# EAGLE design transponder-11.8.0 (EAGLE 9.6.2)
Assembly variants: SMT Stencil, Regulator, Zener

## Sheet 1 of 9
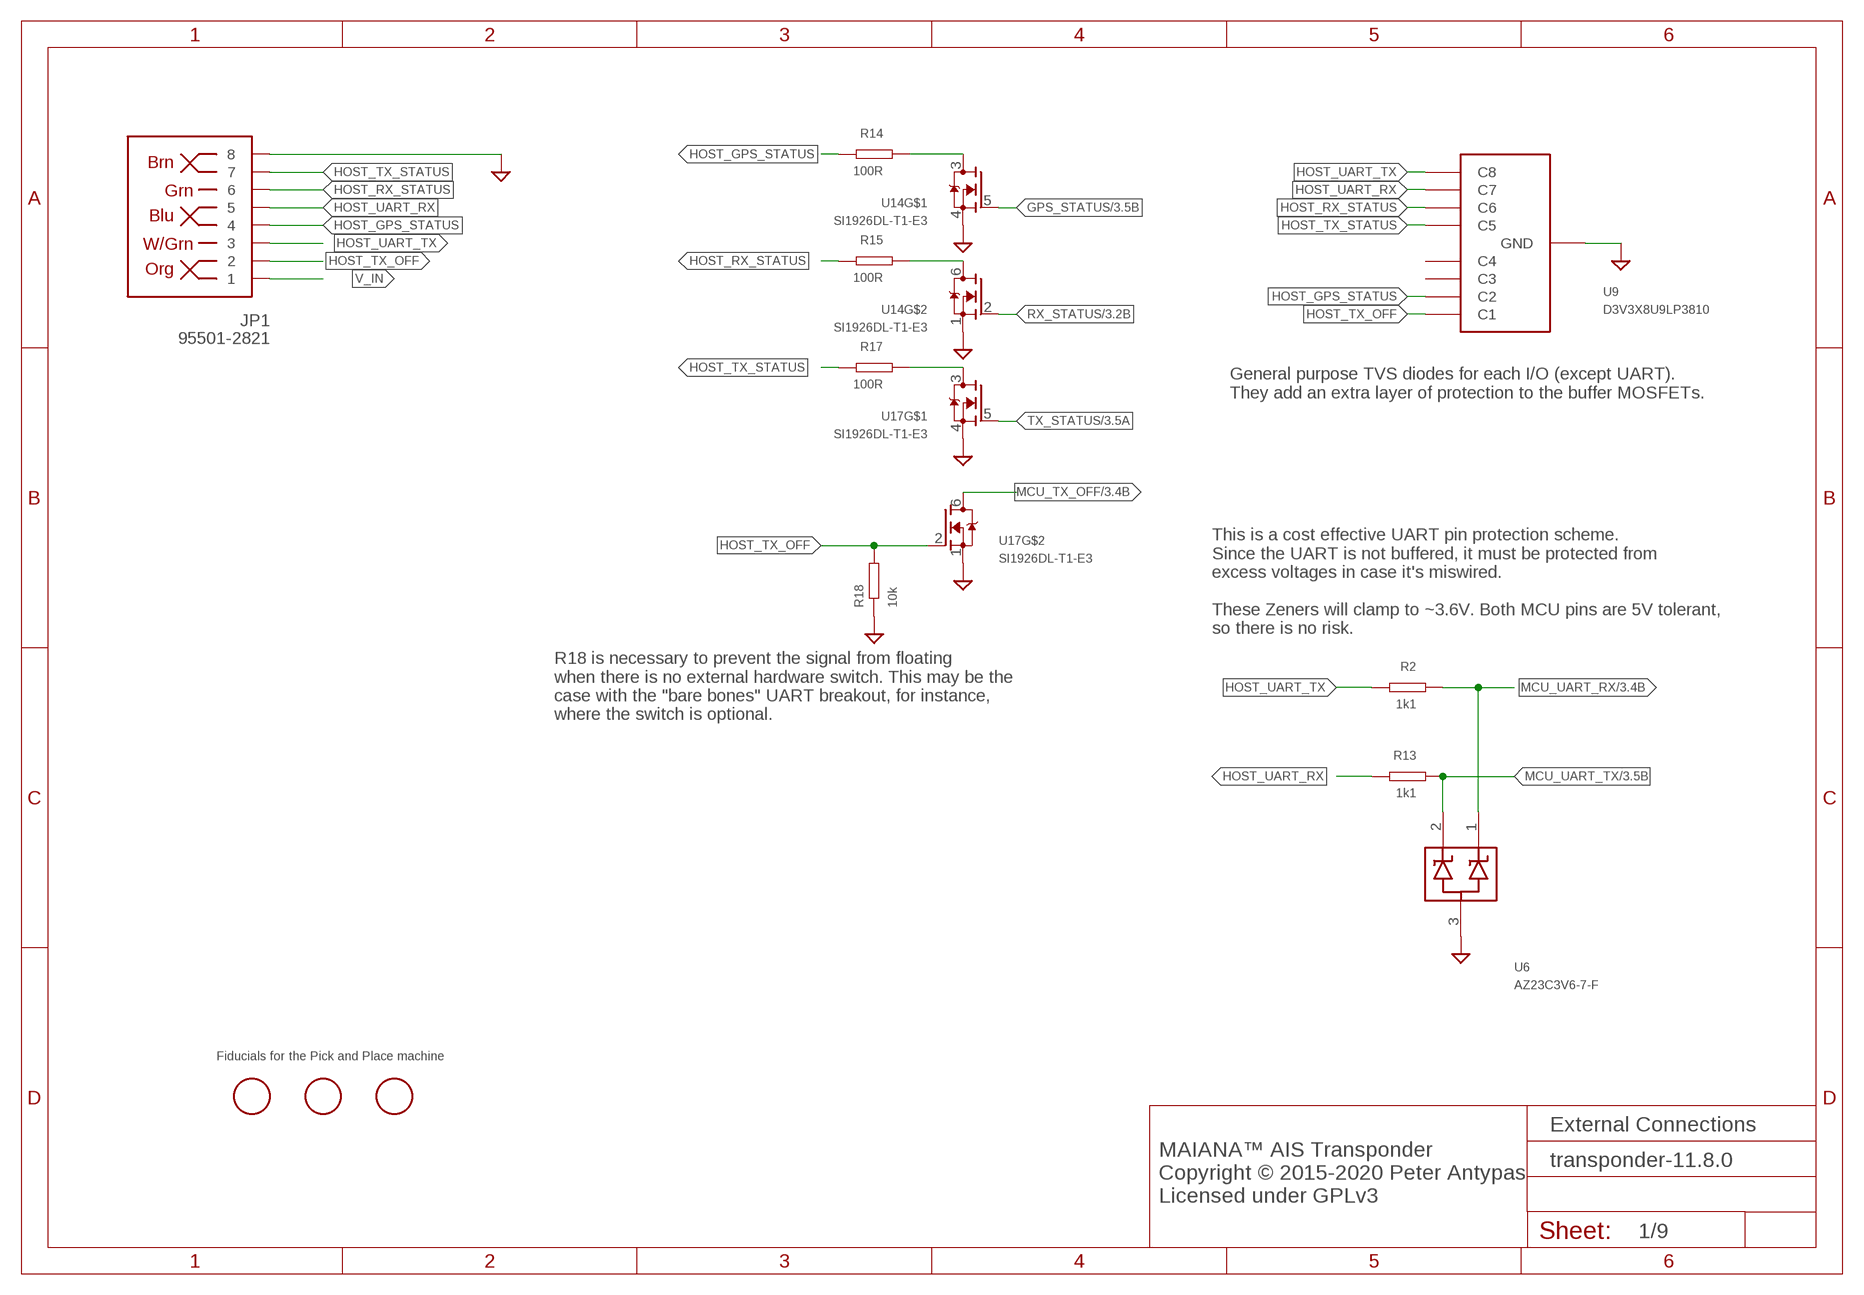
[diagram p0: schematic, sheet 1]

### Parts
JP1  95501-2821  RJ45-8PTH  [RJ45-8]  (not fitted in variant Regulator)  (not fitted in variant Zener)  (not fitted in variant SMT Stencil)
R2  1k1  RESISTOR0603  [0603]
R13  1k1  RESISTOR0603  [0603]
R14  100R  RESISTOR0603  [0603]
R15  100R  RESISTOR0603  [0603]
R17  100R  RESISTOR0603  [0603]
R18  10k  RESISTOR0603  [0603]
U6  AZ23C3V6-7-F  [SOT-23]
U9  D3V3X8U9LP3810  [U-DFN3810-9(B)]
U14  SI1926DL-T1-E3  DMN63D8LDW  [SOT363]
U17  SI1926DL-T1-E3  DMN63D8LDW  [SOT363]
U$1  FIDUCIAL  [FIDUCIAL_1MM]
U$2  FIDUCIAL  [FIDUCIAL_1MM]
U$3  FIDUCIAL  [FIDUCIAL_1MM]

### Nets
GND: JP1.8 R18.P$1 U6.3 U9.P$3(GND) U14.1(S) U14.4(S) U17.1(S) U17.4(S) ; also sheet 2,3,4,5,6,7,8,9
GPS_STATUS: U14.5(G) ; also sheet 3
HOST_GPS_STATUS: JP1.4 R14.P$2 U9.P$2(C2)
HOST_RX_STATUS: JP1.6 R15.P$2 U9.P$7(C6)
HOST_TX_OFF: JP1.2 R18.P$2 U9.P$1(C1) U17.2(G)
HOST_TX_STATUS: JP1.7 R17.P$2 U9.P$6(C5)
HOST_UART_RX: JP1.5 R13.P$2 U9.P$8(C7)
HOST_UART_TX: JP1.3 R2.P$2 U9.P$9(C8)
MCU_TX_OFF: U17.6(D) ; also sheet 3
MCU_UART_RX: R2.P$1 U6.1 ; also sheet 3
MCU_UART_TX: R13.P$1 U6.2 ; also sheet 3
N$13: R14.P$1 U14.3(D)
N$14: R15.P$1 U14.6(D)
N$20: R17.P$1 U17.3(D)
RX_STATUS: U14.2(G) ; also sheet 3
TX_STATUS: U17.5(G) ; also sheet 3
V_IN: JP1.1 ; also sheet 2
Unconnected: U9.P$4(C3) U9.P$5(C4)

### Notes on the sheet
- General purpose TVS diodes for each I/O (except UART).
  They add an extra layer of protection to the buffer MOSFETs.
- This is a cost effective UART pin protection scheme. 
  Since the UART is not buffered, it must be protected from 
  excess voltages in case it's miswired.
  
  These Zeners will clamp to ~3.6V. Both MCU pins are 5V tolerant,
  so there is no risk.
- R18 is necessary to prevent the signal from floating
  when there is no external hardware switch. This may be the
  case with the "bare bones" UART breakout, for instance,
  where the switch is optional.
- Fiducials for the Pick and Place machine
- External Connections
- MAIANA™ AIS Transponder
  Copyright © 2015-2020 Peter Antypas
  Licensed under GPLv3

## Sheet 2 of 9
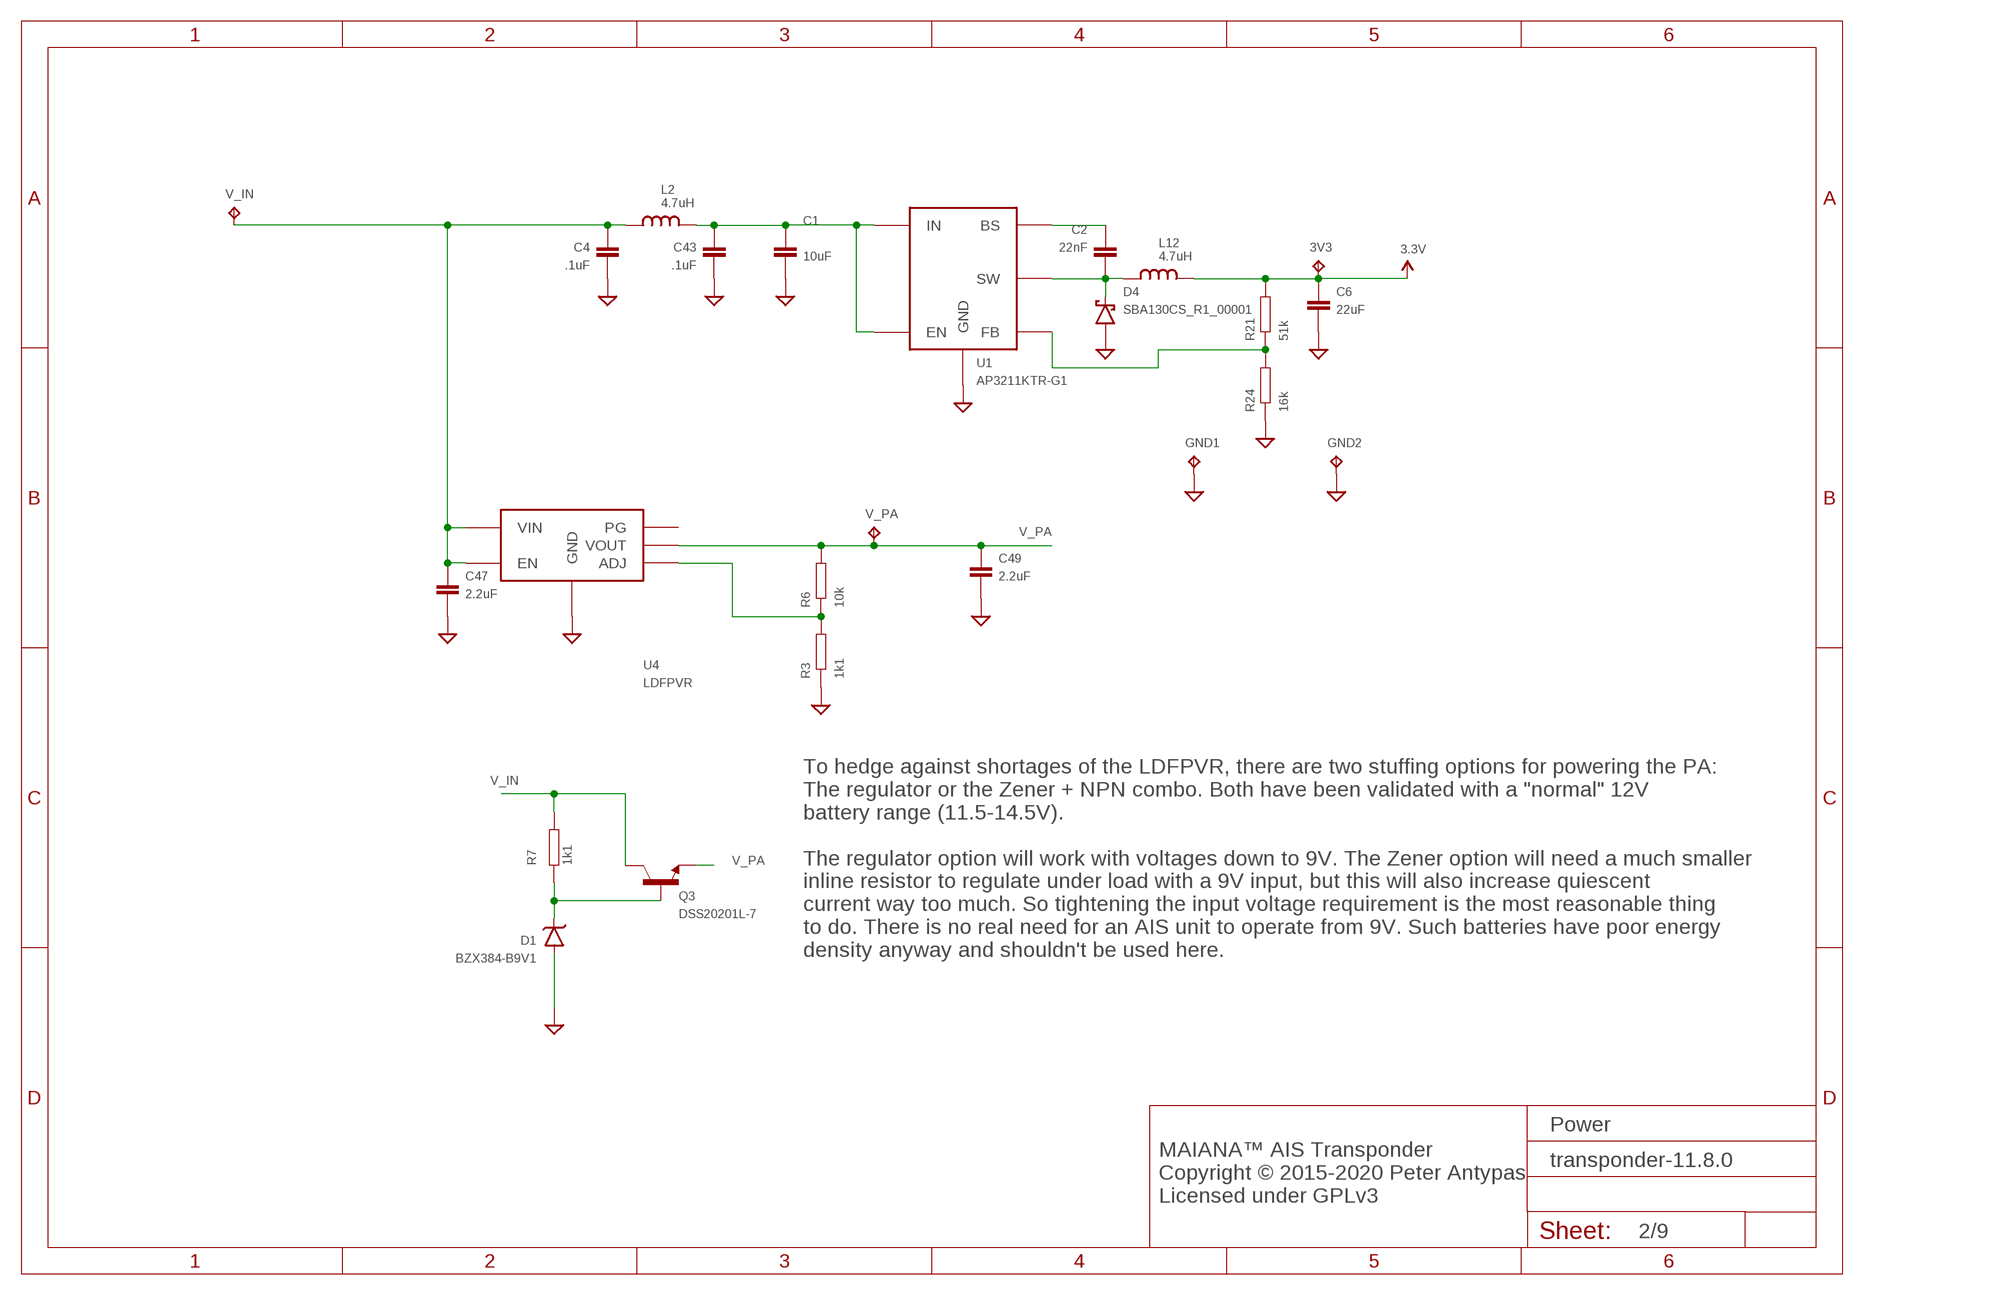
[diagram p1: schematic, sheet 2]

### Parts
3V3  TPTP12R  [TP12R]
C1  10uF  CAPACITOR0805  [0805]
C2  22nF  CAPACITOR0603  [0603]
C4  .1uF  CAPACITOR0603  [0603]
C6  22uF  CAPACITOR0805  [0805]
C43  .1uF  CAPACITOR0603  [0603]
C47  2.2uF  CAPACITOR0603  [0603]
C49  2.2uF  CAPACITOR0603  [0603]
D1  BZX384-B9V1  DIODE-ZENERSOD323  [SOD323]  (not fitted in variant Regulator)
D4  SBA130CS_R1_00001  DIODE-SCHOTTKYSOD323  [SOD323]
GND1  TPTP12R  [TP12R]
GND2  TPTP12R  [TP12R]
L2  4.7uH  INDUCTOR0805  [0805]
L12  4.7uH  INDUCTOR0805  [0805]
Q3  DSS20201L-7  TRANSISTOR_NPNSOT23-3  [SOT23-3]  (not fitted in variant Regulator)
R3  1k1  RESISTOR0603  [0603]  (not fitted in variant Zener)
R6  10k  RESISTOR0603  [0603]  (not fitted in variant Zener)
R7  1k1  RESISTOR0603  [0603]  (not fitted in variant Regulator)
R21  51k  RESISTOR0603  [0603]
R24  16k  RESISTOR0603  [0603]
U1  AP3211KTR-G1  AP3211  [SOT23-6]
U4  LDFPVR  [DFN6-2X2]  (not fitted in variant Zener)
V_IN  TPTP12R  [TP12R]
V_PA  TPTP12R  [TP12R]

### Nets
3.3V: 3V3.TP C6.P$1 L12.P$2 R21.P$2 ; also sheet 3,4,5,6,8,9
GND: C1.P$2 C4.P$2 C6.P$2 C43.P$2 C47.P$2 C49.P$2 D1.A D4.A GND1.TP GND2.TP R3.P$1 R24.P$1 U1.2(GND) U4.P$4(GND) U4.P$7(GND) ; also sheet 1,3,4,5,6,7,8,9
N$8: C2.P$2 D4.C L12.P$1 U1.6(SW)
N$10: D1.C Q3.1(B) R7.P$1
N$21: C2.P$1 U1.1(BS)
N$22: R21.P$1 R24.P$2 U1.3(FB)
N$27: C1.P$1 C43.P$1 L2.P$2 U1.4(EN) U1.5(IN)
N$32: R3.P$2 R6.P$1 U4.P$2(ADJ)
V_IN: C4.P$1 C47.P$1 L2.P$1 Q3.3(C) R7.P$2 U4.P$5(EN) U4.P$6(VIN) V_IN.TP ; also sheet 1
V_PA: C49.P$1 Q3.2(E) R6.P$2 U4.P$1(VOUT) V_PA.TP ; also sheet 7
Unconnected: U4.P$3(PG)

### Notes on the sheet
- To hedge against shortages of the LDFPVR, there are two stuffing options for powering the PA: 
  The regulator or the Zener + NPN combo. Both have been validated with a "normal" 12V 
  battery range (11.5-14.5V). 
  
  The regulator option will work with voltages down to 9V. The Zener option will need a much smaller
  inline resistor to regulate under load with a 9V input, but this will also increase quiescent 
  current way too much. So tightening the input voltage requirement is the most reasonable thing
  to do. There is no real need for an AIS unit to operate from 9V. Such batteries have poor energy
  density anyway and shouldn't be used here.
- Power
- MAIANA™ AIS Transponder
  Copyright © 2015-2020 Peter Antypas
  Licensed under GPLv3

## Sheet 3 of 9
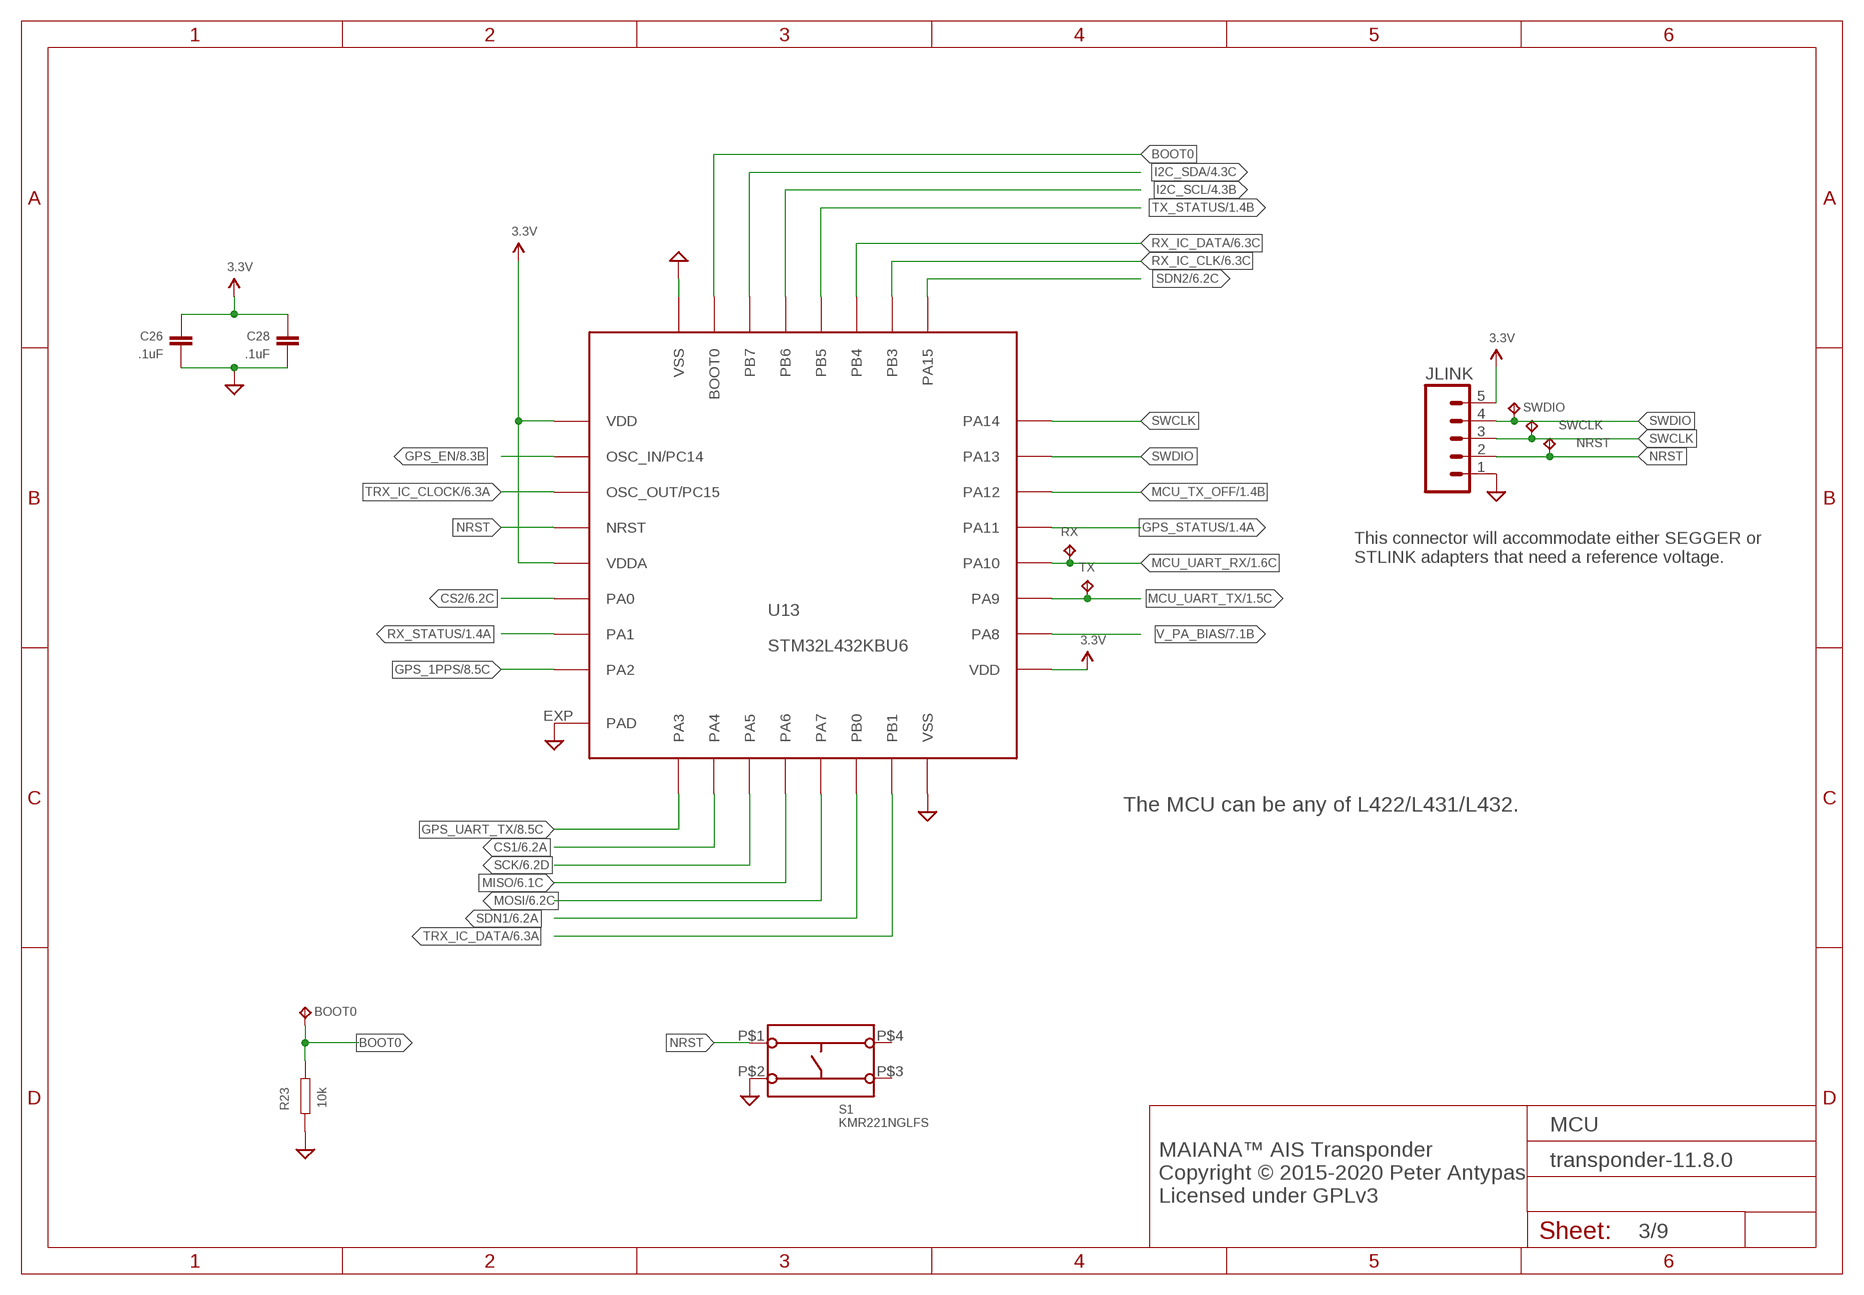
[diagram p2: schematic, sheet 3]

### Parts
BOOT0  TPTP12R  [TP12R]
C26  .1uF  CAPACITOR0603  [0603]
C28  .1uF  CAPACITOR0603  [0603]
JLINK  M05PTH  [1X05]  (not fitted in variant Regulator)  (not fitted in variant Zener)  (not fitted in variant SMT Stencil)
NRST  TPTP12R  [TP12R]
R23  10k  RESISTOR0603  [0603]
RX  TPTP12R  [TP12R]
S1  KMR221NGLFS  [KMR221NGLFS]  (not fitted in variant Regulator)  (not fitted in variant Zener)
SWCLK  TPTP12R  [TP12R]
SWDIO  TPTP12R  [TP12R]
TX  TPTP12R  [TP12R]
U13  STM32L432KBU6  STM32L432KXXX  [QFN32]

### Nets
3.3V: C26.P$1 C28.P$1 JLINK.5 U13.1(VDD) U13.5(VDDA) U13.17(VDD) ; also sheet 2,4,5,6,8,9
BOOT0: BOOT0.TP R23.P$1 U13.31(BOOT0)
CS1: U13.10(PA4) ; also sheet 6
CS2: U13.6(PA0) ; also sheet 6
GND: C26.P$2 C28.P$2 JLINK.1 R23.P$2 S1.P$2(S2) U13.16(VSS) U13.32(VSS) U13.EXP(PAD) ; also sheet 1,2,4,5,6,7,8,9
GPS_1PPS: U13.8(PA2) ; also sheet 8
GPS_EN: U13.2(OSC_IN/PC14) ; also sheet 8
GPS_STATUS: U13.21(PA11) ; also sheet 1
GPS_UART_TX: U13.9(PA3) ; also sheet 8
I2C_SCL: U13.29(PB6) ; also sheet 4
I2C_SDA: U13.30(PB7) ; also sheet 4
MCU_TX_OFF: U13.22(PA12) ; also sheet 1
MCU_UART_RX: RX.TP U13.20(PA10) ; also sheet 1
MCU_UART_TX: TX.TP U13.19(PA9) ; also sheet 1
MISO: U13.12(PA6) ; also sheet 6
MOSI: U13.13(PA7) ; also sheet 6
NRST: JLINK.2 NRST.TP S1.P$1(S1) U13.4(NRST)
RX_IC_CLK: U13.26(PB3) ; also sheet 6
RX_IC_DATA: U13.27(PB4) ; also sheet 6
RX_STATUS: U13.7(PA1) ; also sheet 1
SCK: U13.11(PA5) ; also sheet 6
SDN1: U13.14(PB0) ; also sheet 6
SDN2: U13.25(PA15) ; also sheet 6
SWCLK: JLINK.3 SWCLK.TP U13.24(PA14)
SWDIO: JLINK.4 SWDIO.TP U13.23(PA13)
TRX_IC_CLOCK: U13.3(OSC_OUT/PC15) ; also sheet 6
TRX_IC_DATA: U13.15(PB1) ; also sheet 6
TX_STATUS: U13.28(PB5) ; also sheet 1
V_PA_BIAS: U13.18(PA8) ; also sheet 7
Unconnected: S1.P$3(S2) S1.P$4(S1)

### Notes on the sheet
- This connector will accommodate either SEGGER or
  STLINK adapters that need a reference voltage.
- The MCU can be any of L422/L431/L432.
- MCU
- MAIANA™ AIS Transponder
  Copyright © 2015-2020 Peter Antypas
  Licensed under GPLv3

## Sheet 4 of 9
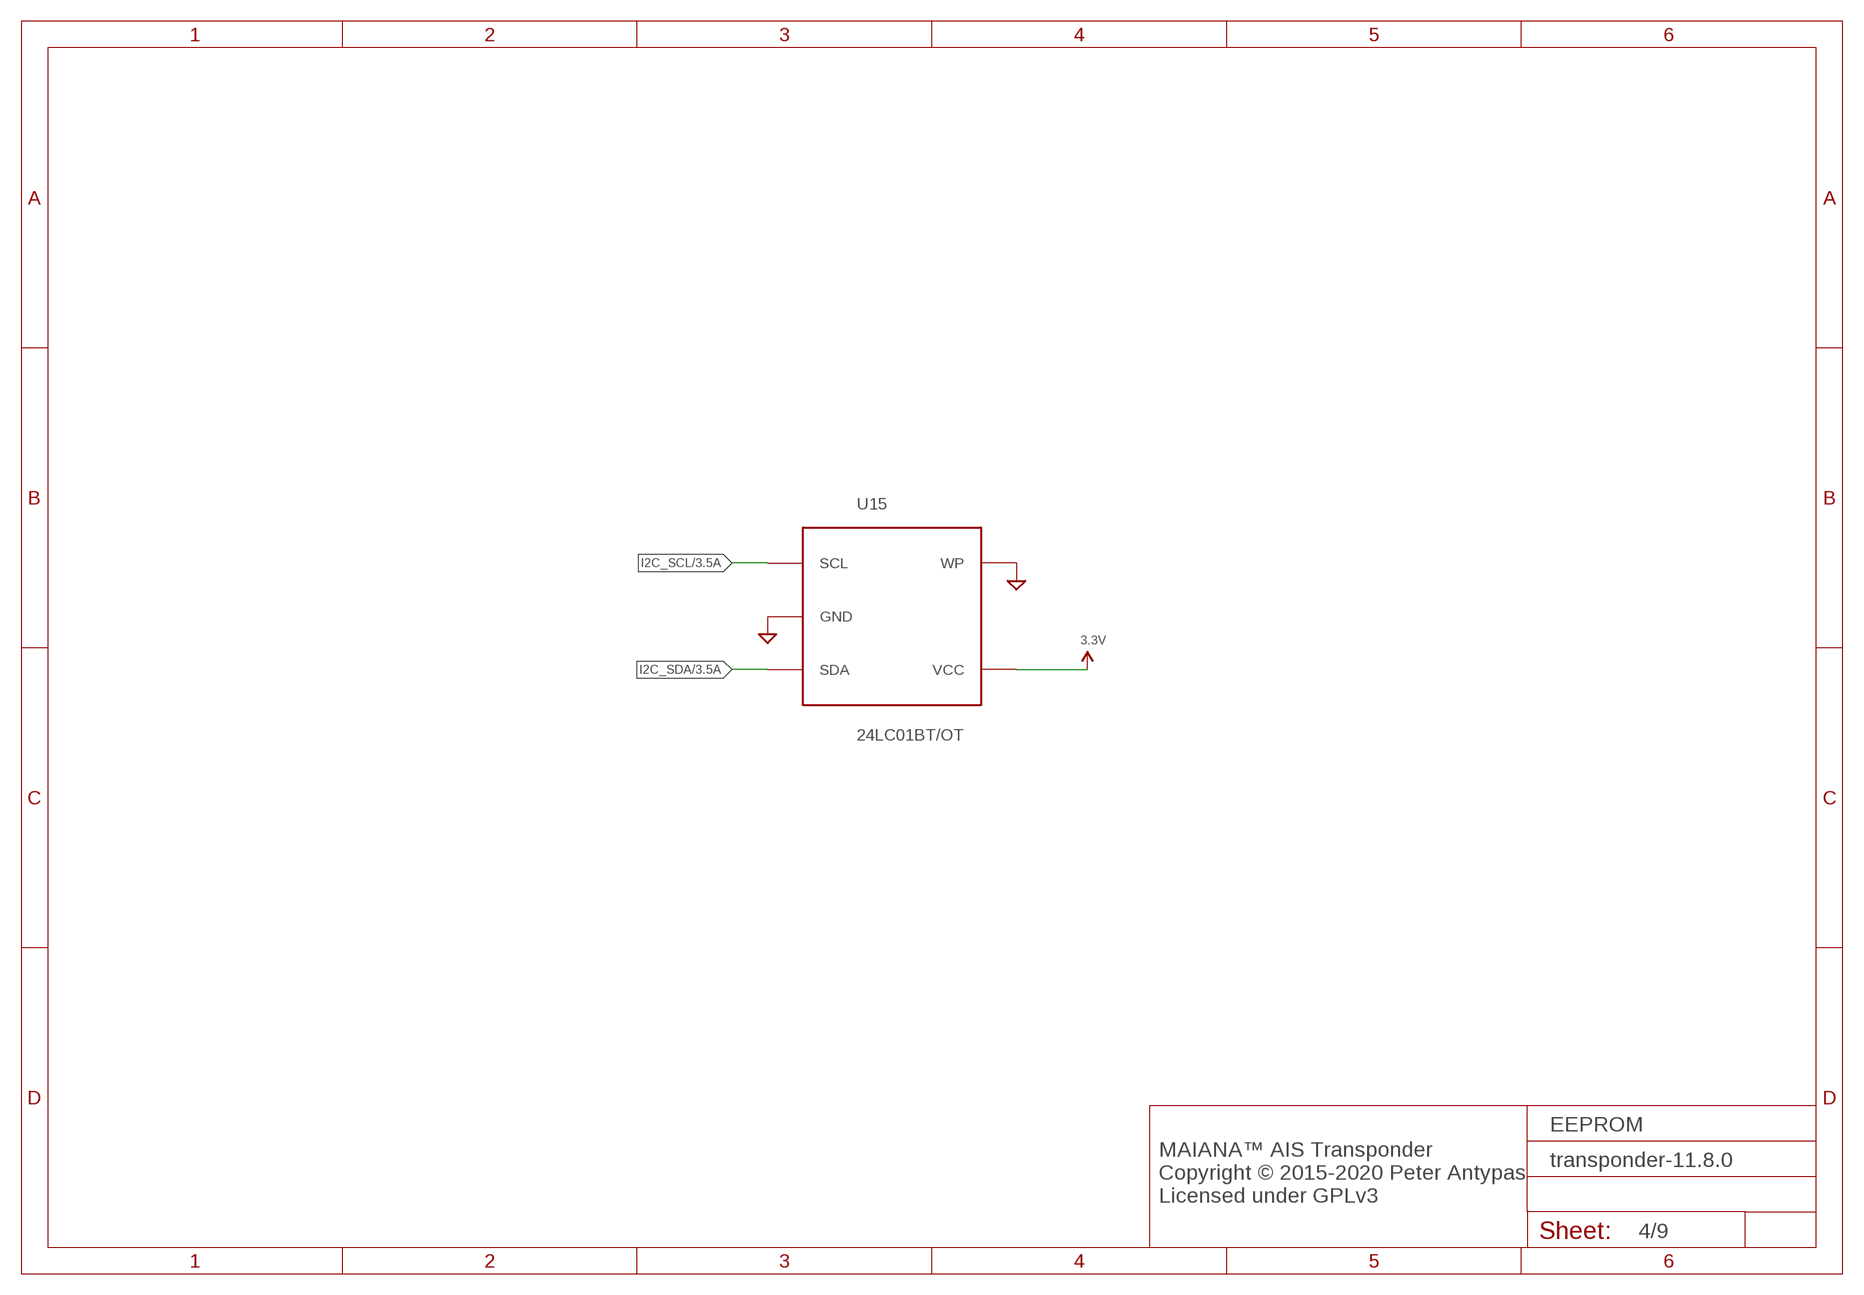
[diagram p3: schematic, sheet 4]

### Parts
U15  24LC01BT/OT  24LC01B  [SOT23-5]

### Nets
3.3V: U15.4(VCC) ; also sheet 2,3,5,6,8,9
GND: U15.2(GND) U15.5(WP) ; also sheet 1,2,3,5,6,7,8,9
I2C_SCL: U15.1(SCL) ; also sheet 3
I2C_SDA: U15.3(SDA) ; also sheet 3

### Notes on the sheet
- EEPROM
- MAIANA™ AIS Transponder
  Copyright © 2015-2020 Peter Antypas
  Licensed under GPLv3

## Sheet 5 of 9
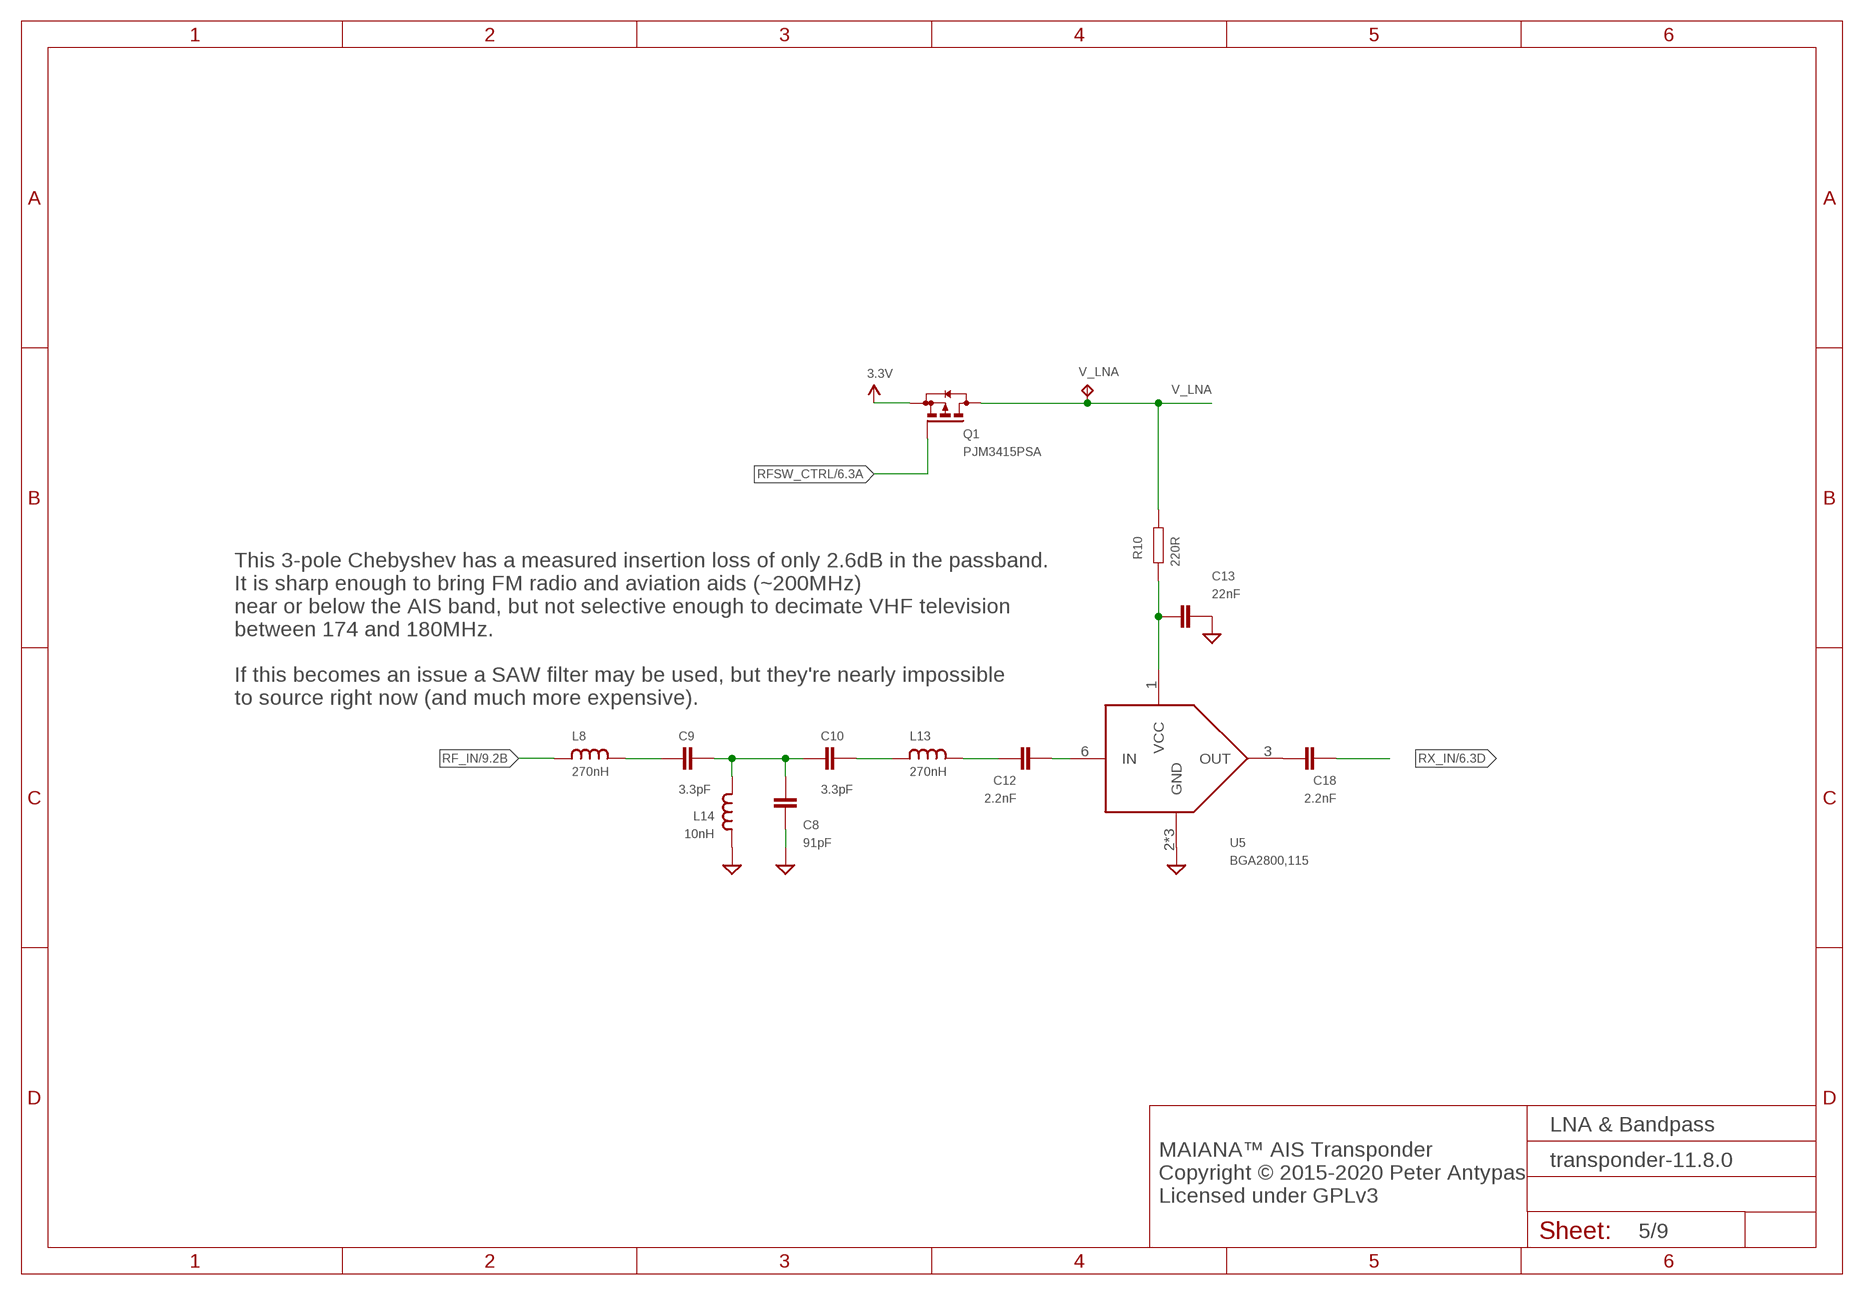
[diagram p4: schematic, sheet 5]

### Parts
C8  91pF  CAPACITOR0603  [0603]
C9  3.3pF  CAPACITOR0603  [0603]
C10  3.3pF  CAPACITOR0603  [0603]
C12  2.2nF  CAPACITOR0603  [0603]
C13  22nF  CAPACITOR0603  [0603]
C18  2.2nF  CAPACITOR0603  [0603]
L8  270nH  INDUCTOR0603  [0603]
L13  270nH  INDUCTOR0603  [0603]
L14  10nH  INDUCTOR0603  [0603]
Q1  PJM3415PSA  BSS84  [SOT23]
R10  220R  RESISTOR0603  [0603]
U5  BGA2800,115  BGA2870  [SOT363]
V_LNA  TPTP12R  [TP12R]

### Nets
3.3V: Q1.2(S) ; also sheet 2,3,4,6,8,9
GND: C8.P$2 C13.P$2 L14.P$1 U5.2(GND) U5.4(GND) U5.5(GND) ; also sheet 1,2,3,4,6,7,8,9
N$1: C12.P$2 U5.6(IN)
N$2: C9.P$1 L8.P$2
N$3: C8.P$1 C9.P$2 C10.P$1 L14.P$2
N$4: C10.P$2 L13.P$1
N$5: C12.P$1 L13.P$2
N$6: C13.P$1 R10.P$2 U5.1(VCC)
N$9: C18.P$1 U5.3(OUT)
RF_IN: L8.P$1 ; also sheet 9
RFSW_CTRL: Q1.1(G) ; also sheet 6
RX_IN: C18.P$2 ; also sheet 6
V_LNA: Q1.3(D) R10.P$1 V_LNA.TP ; also sheet 9

### Notes on the sheet
- This 3-pole Chebyshev has a measured insertion loss of only 2.6dB in the passband.
  It is sharp enough to bring FM radio and aviation aids (~200MHz)
  near or below the AIS band, but not selective enough to decimate VHF television
  between 174 and 180MHz. 
  
  If this becomes an issue a SAW filter may be used, but they're nearly impossible
  to source right now (and much more expensive).
- LNA & Bandpass
- MAIANA™ AIS Transponder
  Copyright © 2015-2020 Peter Antypas
  Licensed under GPLv3

## Sheet 6 of 9
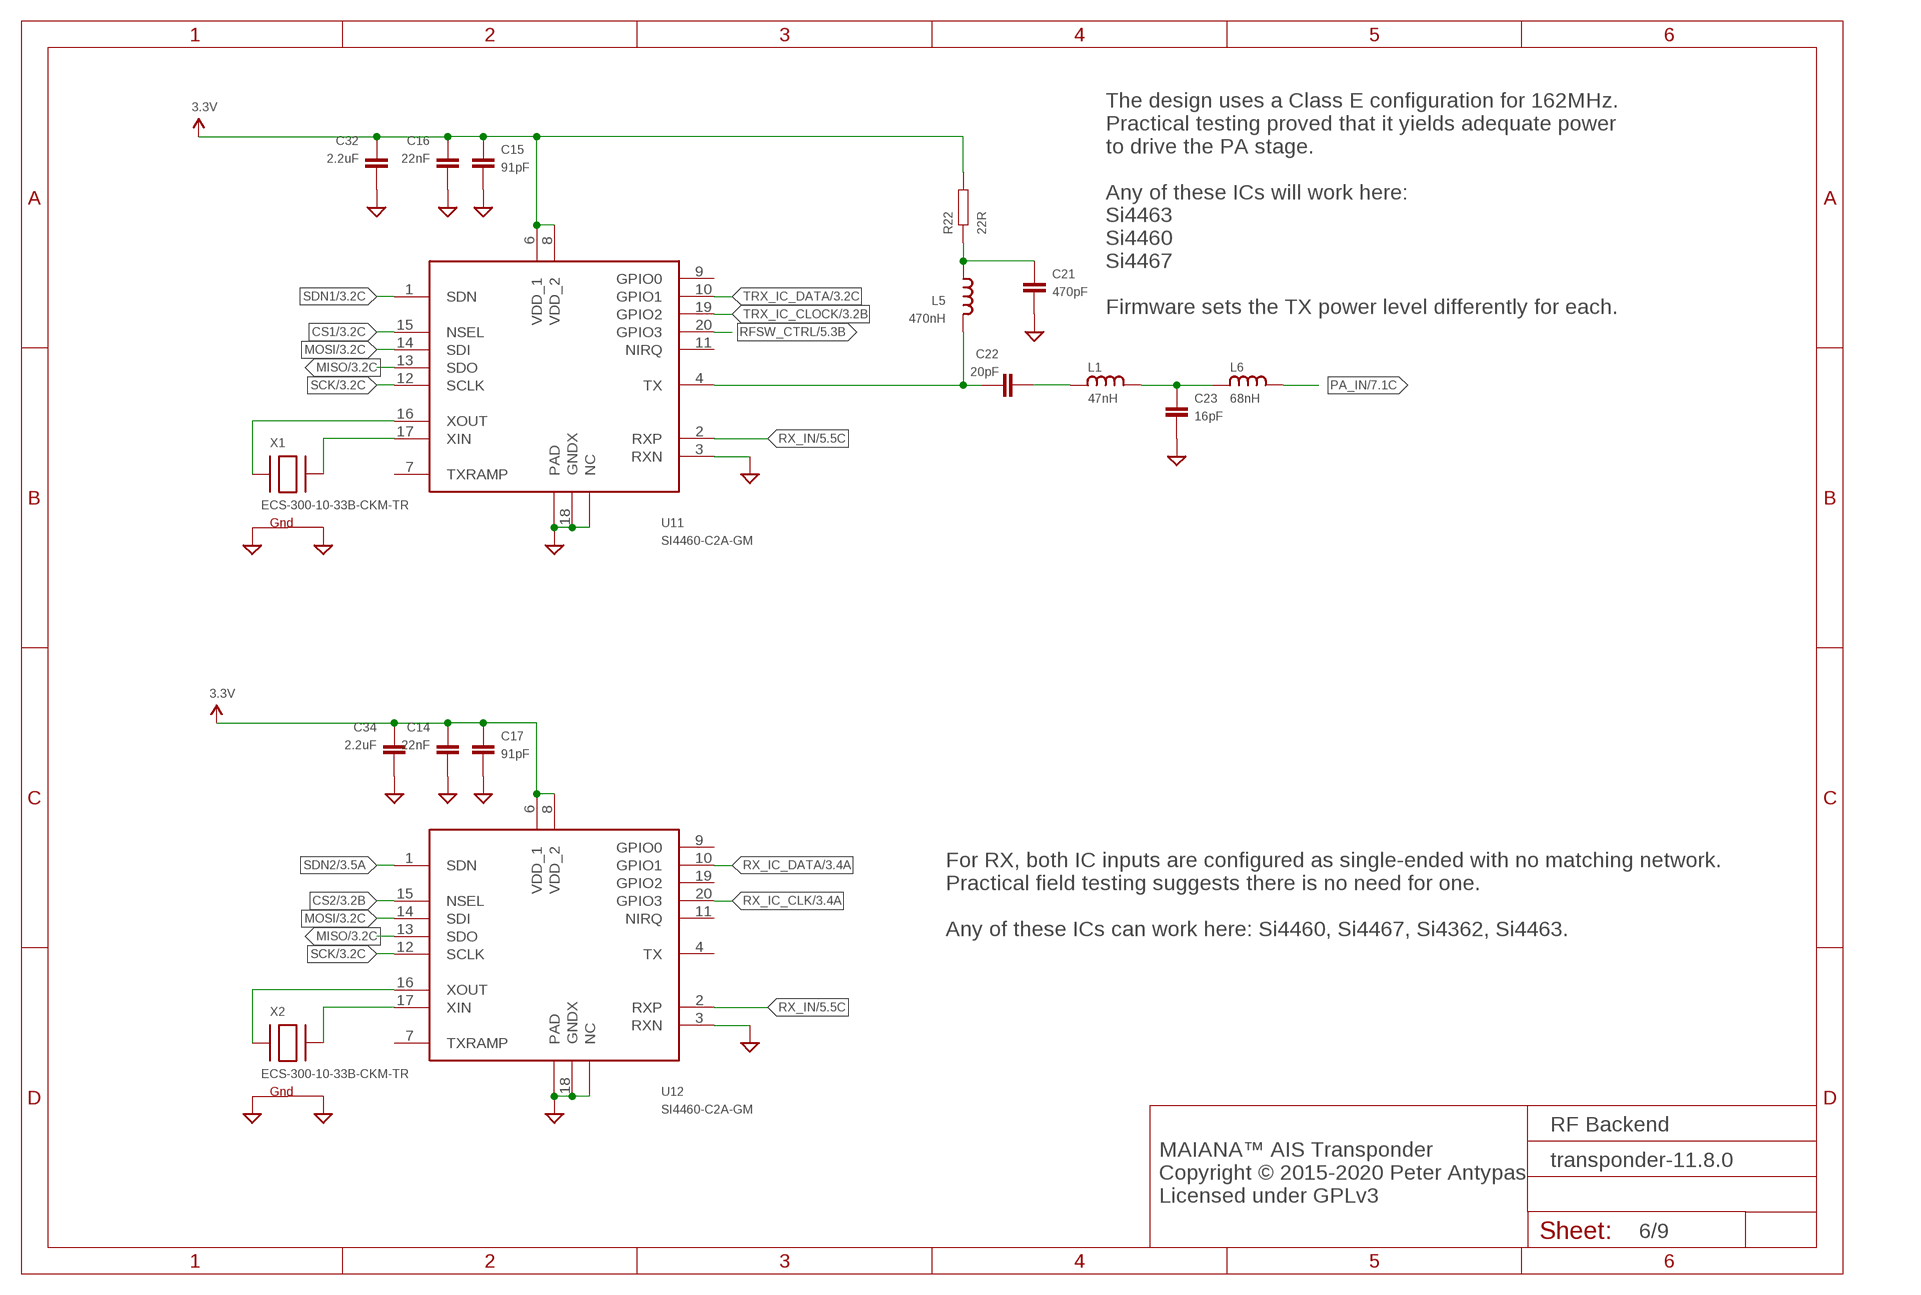
[diagram p5: schematic, sheet 6]

### Parts
C14  22nF  CAPACITOR0603  [0603]
C15  91pF  CAPACITOR0603  [0603]
C16  22nF  CAPACITOR0603  [0603]
C17  91pF  CAPACITOR0603  [0603]
C21  470pF  CAPACITOR0603  [0603]
C22  20pF  CAPACITOR0603  [0603]
C23  16pF  CAPACITOR0603  [0603]
C32  2.2uF  CAPACITOR0603  [0603]
C34  2.2uF  CAPACITOR0603  [0603]
L1  47nH  INDUCTOR0603  [0603]
L5  470nH  INDUCTOR0603  [0603]
L6  68nH  INDUCTOR0603  [0603]
R22  22R  RESISTOR0603  [0603]
U11  SI4460-C2A-GM  SI4463  [QFN20]
U12  SI4460-C2A-GM  SI4463  [QFN20]
X1  ECS-300-10-33B-CKM-TR  XTAL-4-3225  [NX3225]
X2  ECS-300-10-33B-CKM-TR  XTAL-4-3225  [NX3225]

### Nets
3.3V: C14.P$1 C15.P$1 C16.P$1 C17.P$1 C32.P$1 C34.P$1 R22.P$2 U11.6(VDD_1) U11.8(VDD_2) U12.6(VDD_1) U12.8(VDD_2) ; also sheet 2,3,4,5,8,9
CS1: U11.15(NSEL) ; also sheet 3
CS2: U12.15(NSEL) ; also sheet 3
GND: C14.P$2 C15.P$2 C16.P$2 C17.P$2 C21.P$2 C23.P$2 C32.P$2 C34.P$2 U11.3(RXN) U11.5(NC) U11.18(GNDX) U11.EXP(PAD) U12.3(RXN) U12.5(NC) U12.18(GNDX) U12.EXP(PAD) X1.2(G2) X1.4(G1) X2.2(G2) X2.4(G1) ; also sheet 1,2,3,4,5,7,8,9
MISO: U11.13(SDO) U12.13(SDO) ; also sheet 3
MOSI: U11.14(SDI) U12.14(SDI) ; also sheet 3
N$12: C23.P$1 L1.P$2 L6.P$1
N$16: U12.16(XOUT) X2.1(X1)
N$17: U12.17(XIN) X2.3(X2)
N$18: U11.16(XOUT) X1.1(X1)
N$19: U11.17(XIN) X1.3(X2)
N$24: C22.P$1 L5.P$2 U11.4(TX)
N$30: C21.P$1 L5.P$1 R22.P$1
N$31: C22.P$2 L1.P$1
PA_IN: L6.P$2 ; also sheet 7
RFSW_CTRL: U11.20(GPIO3) ; also sheet 5
RX_IC_CLK: U12.20(GPIO3) ; also sheet 3
RX_IC_DATA: U12.10(GPIO1) ; also sheet 3
RX_IN: U11.2(RXP) U12.2(RXP) ; also sheet 5
SCK: U11.12(SCLK) U12.12(SCLK) ; also sheet 3
SDN1: U11.1(SDN) ; also sheet 3
SDN2: U12.1(SDN) ; also sheet 3
TRX_IC_CLOCK: U11.19(GPIO2) ; also sheet 3
TRX_IC_DATA: U11.10(GPIO1) ; also sheet 3
Unconnected: U11.7(TXRAMP) U11.9(GPIO0) U11.11(NIRQ) U12.4(TX) U12.7(TXRAMP) U12.9(GPIO0) U12.11(NIRQ) U12.19(GPIO2)

### Notes on the sheet
- The design uses a Class E configuration for 162MHz. 
  Practical testing proved that it yields adequate power 
  to drive the PA stage. 
  
  Any of these ICs will work here:
  Si4463
  Si4460
  Si4467
  
  Firmware sets the TX power level differently for each.
- For RX, both IC inputs are configured as single-ended with no matching network. 
  Practical field testing suggests there is no need for one.
  
  Any of these ICs can work here: Si4460, Si4467, Si4362, Si4463.
- RF Backend
- MAIANA™ AIS Transponder
  Copyright © 2015-2020 Peter Antypas
  Licensed under GPLv3

## Sheet 7 of 9
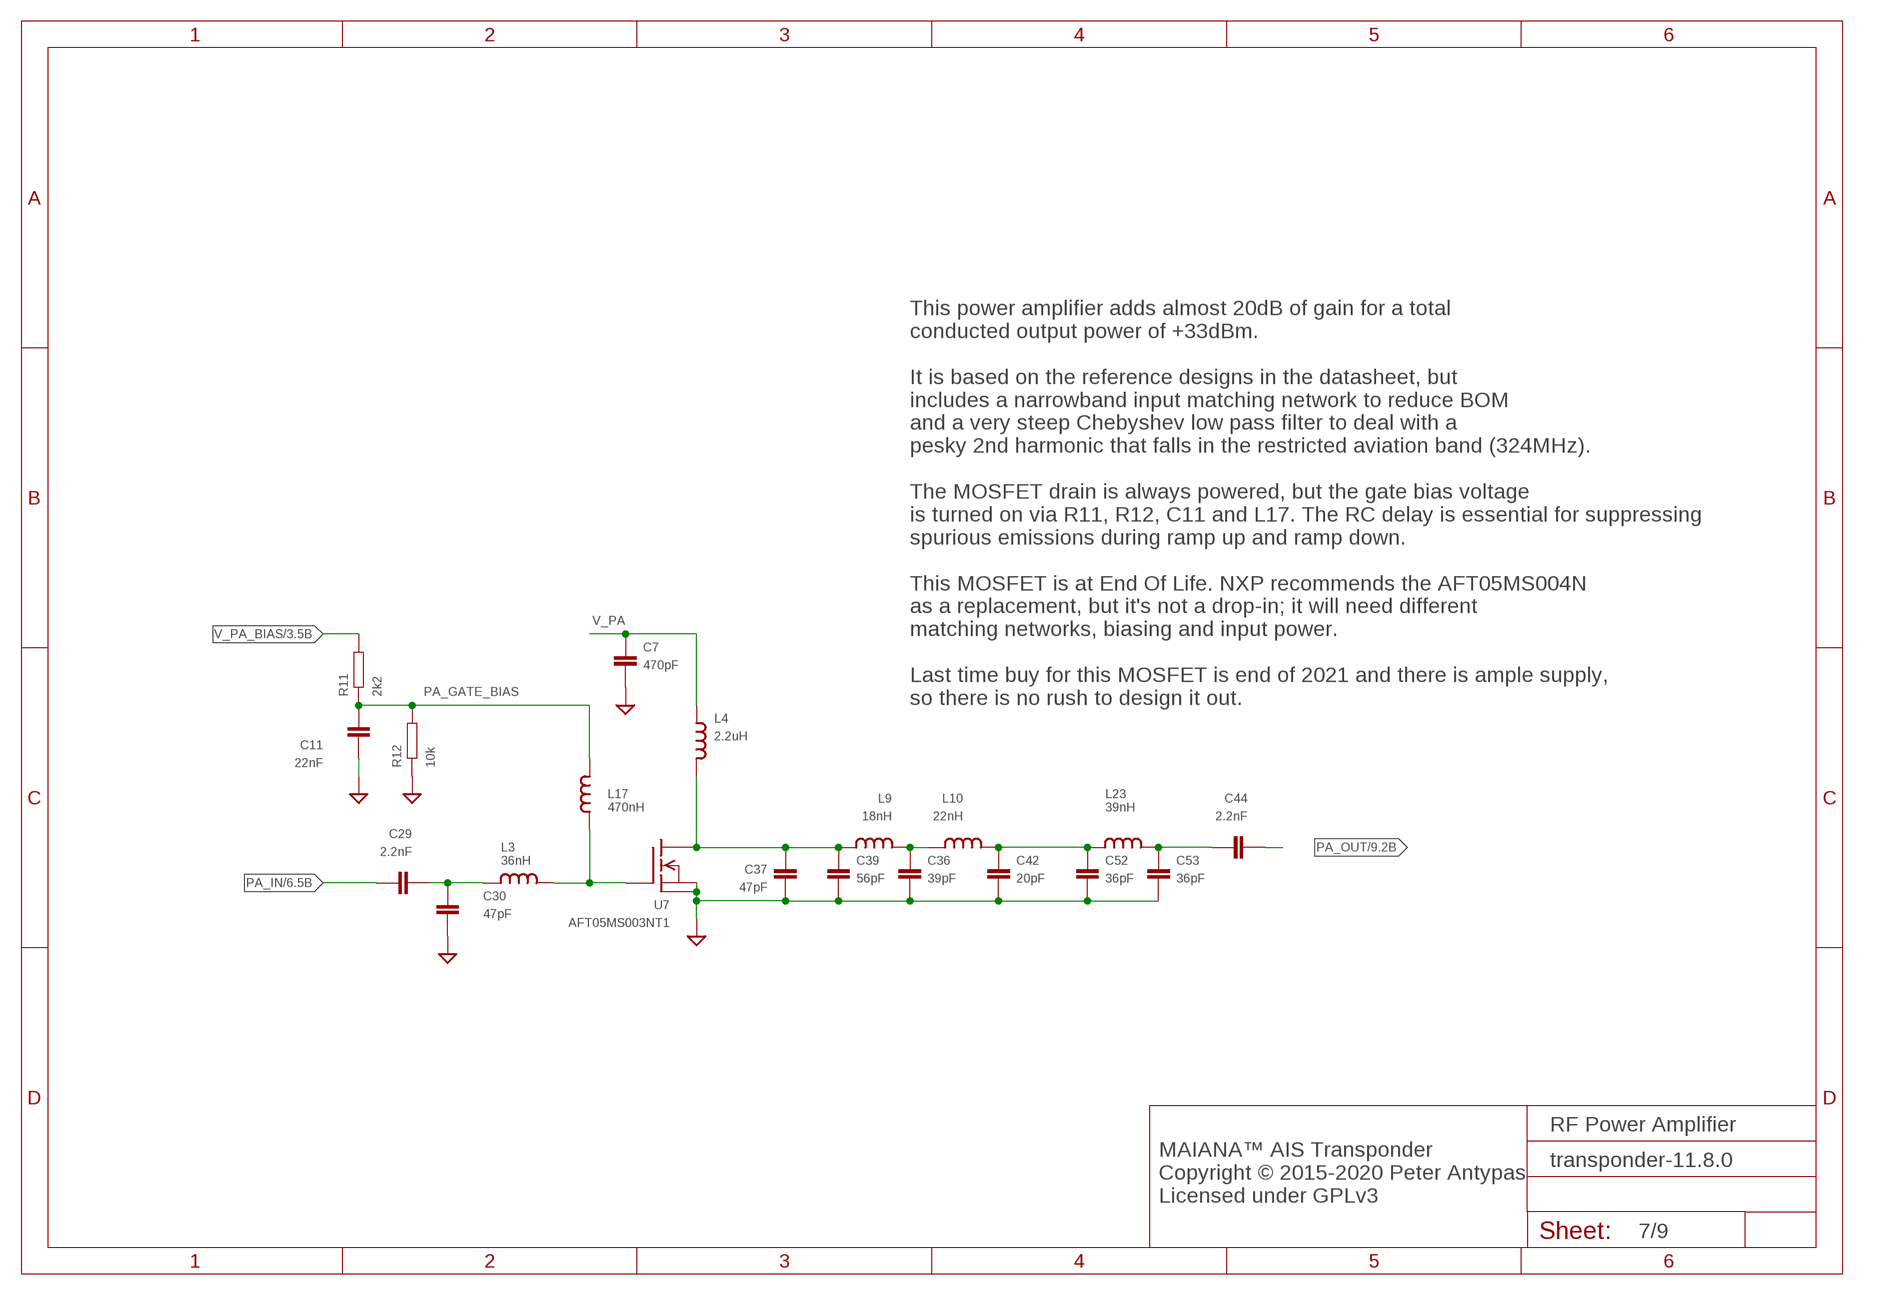
[diagram p6: schematic, sheet 7]

### Parts
C7  470pF  CAPACITOR0603  [0603]
C11  22nF  CAPACITOR0603  [0603]
C29  2.2nF  CAPACITOR0603  [0603]
C30  47pF  CAPACITOR0603  [0603]
C36  39pF  CAPACITOR0603  [0603]
C37  47pF  CAPACITOR0603  [0603]
C39  56pF  CAPACITOR0603  [0603]
C42  20pF  CAPACITOR0603  [0603]
C44  2.2nF  CAPACITOR0603  [0603]
C52  36pF  CAPACITOR0603  [0603]
C53  36pF  CAPACITOR0603  [0603]
L3  36nH  INDUCTOR0603  [0603]
L4  2.2uH  INDUCTOR0805  [0805]
L9  18nH  INDUCTOR0603  [0603]
L10  22nH  INDUCTOR0603  [0603]
L17  470nH  INDUCTOR0603  [0603]
L23  39nH  INDUCTOR0603  [0603]
R11  2k2  RESISTOR0603  [0603]
R12  10k  RESISTOR0603  [0603]
U7  AFT05MS003NT1  AFT0SMS003N  [SOT-89]

### Nets
GND: C7.P$2 C11.P$2 C30.P$2 C36.P$2 C37.P$2 C39.P$2 C42.P$2 C52.P$2 C53.P$2 R12.P$1 U7.2(S) U7.2@1(PAD) ; also sheet 1,2,3,4,5,6,8,9
N$23: C37.P$1 C39.P$1 L4.P$2 L9.P$1 U7.3(D)
N$26: L3.P$2 L17.P$1 U7.1(G)
N$28: C36.P$1 L9.P$2 L10.P$1
N$29: C29.P$2 C30.P$1 L3.P$1
N$40: C42.P$1 C52.P$1 L10.P$2 L23.P$1
N$41: C44.P$1 C53.P$1 L23.P$2
PA_GATE_BIAS: C11.P$1 L17.P$2 R11.P$1 R12.P$2
PA_IN: C29.P$1 ; also sheet 6
PA_OUT: C44.P$2 ; also sheet 9
V_PA: C7.P$1 L4.P$1 ; also sheet 2
V_PA_BIAS: R11.P$2 ; also sheet 3

### Notes on the sheet
- This power amplifier adds almost 20dB of gain for a total
  conducted output power of +33dBm. 
  
  It is based on the reference designs in the datasheet, but
  includes a narrowband input matching network to reduce BOM
  and a very steep Chebyshev low pass filter to deal with a
  pesky 2nd harmonic that falls in the restricted aviation band (324MHz).
  
  The MOSFET drain is always powered, but the gate bias voltage
  is turned on via R11, R12, C11 and L17. The RC delay is essential for suppressing
  spurious emissions during ramp up and ramp down.
  
  This MOSFET is at End Of Life. NXP recommends the AFT05MS004N 
  as a replacement, but it's not a drop-in; it will need different
  matching networks, biasing and input power.
  
  Last time buy for this MOSFET is end of 2021 and there is ample supply,
  so there is no rush to design it out.
- RF Power Amplifier
- MAIANA™ AIS Transponder
  Copyright © 2015-2020 Peter Antypas
  Licensed under GPLv3

## Sheet 8 of 9
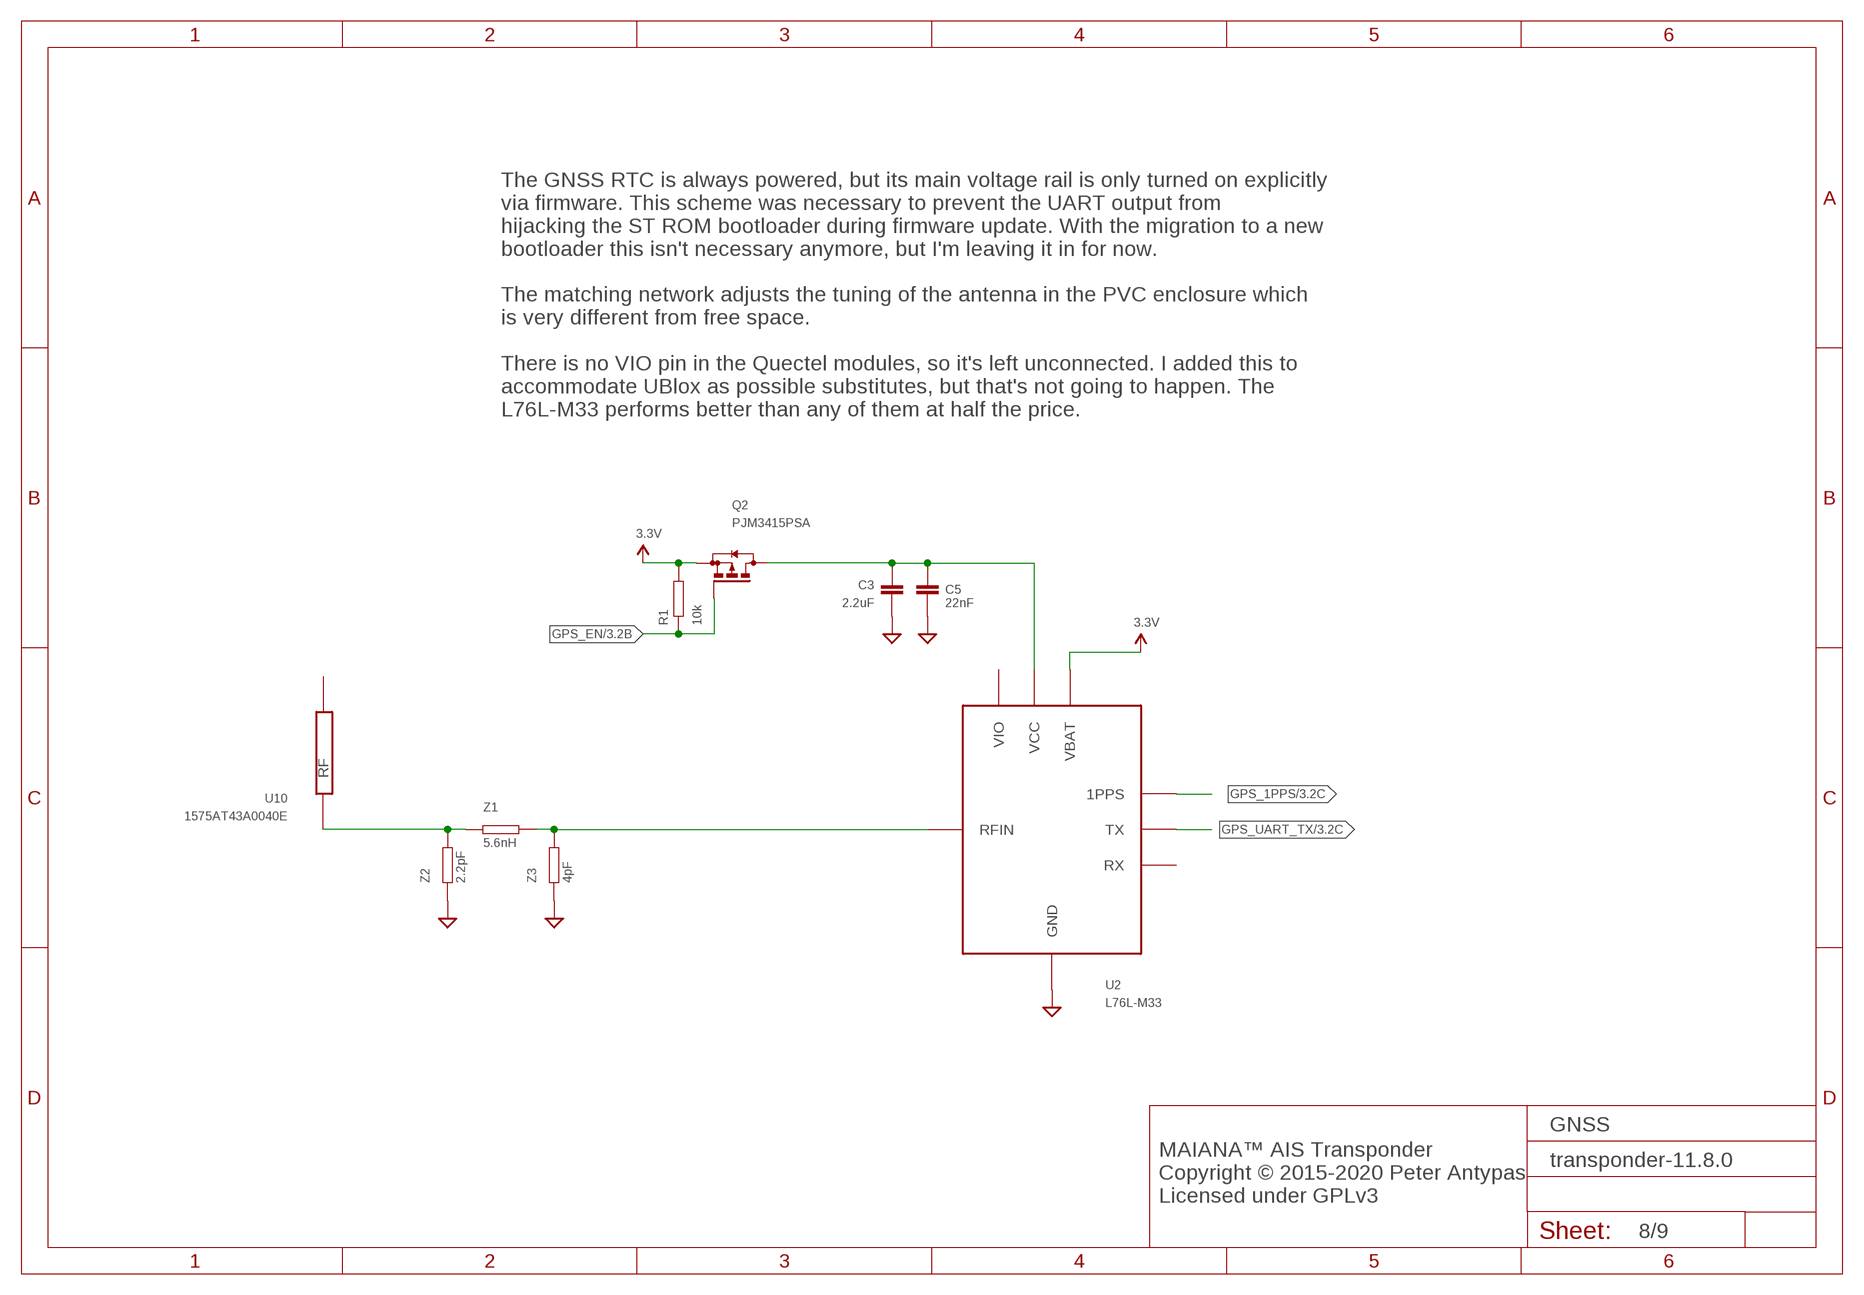
[diagram p7: schematic, sheet 8]

### Parts
C3  2.2uF  CAPACITOR0603  [0603]
C5  22nF  CAPACITOR0603  [0603]
Q2  PJM3415PSA  BSS84  [SOT23]
R1  10k  RESISTOR0603  [0603]
U2  L76L-M33  L70  [GPS_MODULE]
U10  1575AT43A0040E  [1575AT43A0040E]
Z1  5.6nH  RESISTOR0603  [0603]
Z2  2.2pF  RESISTOR0603  [0603]
Z3  4pF  RESISTOR0603  [0603]

### Nets
3.3V: Q2.2(S) R1.P$2 U2.P$6(VBAT) ; also sheet 2,3,4,5,6,9
GND: C3.P$2 C5.P$2 U2.P$1(GND) U2.P$10(GND) U2.P$12(GND) Z2.P$1 Z3.P$1 ; also sheet 1,2,3,4,5,6,7,9
GPS_1PPS: U2.P$4(1PPS) ; also sheet 3
GPS_EN: Q2.1(G) R1.P$1 ; also sheet 3
GPS_UART_TX: U2.P$2(TX) ; also sheet 3
N$7: C3.P$1 C5.P$1 Q2.3(D) U2.P$8(VCC)
N$33: U10.P$1(RF) Z1.P$1 Z2.P$2
N$36: U2.P$11(RFIN) Z1.P$2 Z3.P$2
Unconnected: U2.P$3(RX) U2.P$7(VIO) U10.P$2(PAD)

### Notes on the sheet
- The GNSS RTC is always powered, but its main voltage rail is only turned on explicitly
  via firmware. This scheme was necessary to prevent the UART output from 
  hijacking the ST ROM bootloader during firmware update. With the migration to a new 
  bootloader this isn't necessary anymore, but I'm leaving it in for now.
  
  The matching network adjusts the tuning of the antenna in the PVC enclosure which
  is very different from free space.
  
  There is no VIO pin in the Quectel modules, so it's left unconnected. I added this to
  accommodate UBlox as possible substitutes, but that's not going to happen. The
  L76L-M33 performs better than any of them at half the price.
- GNSS
- MAIANA™ AIS Transponder
  Copyright © 2015-2020 Peter Antypas
  Licensed under GPLv3

## Sheet 9 of 9
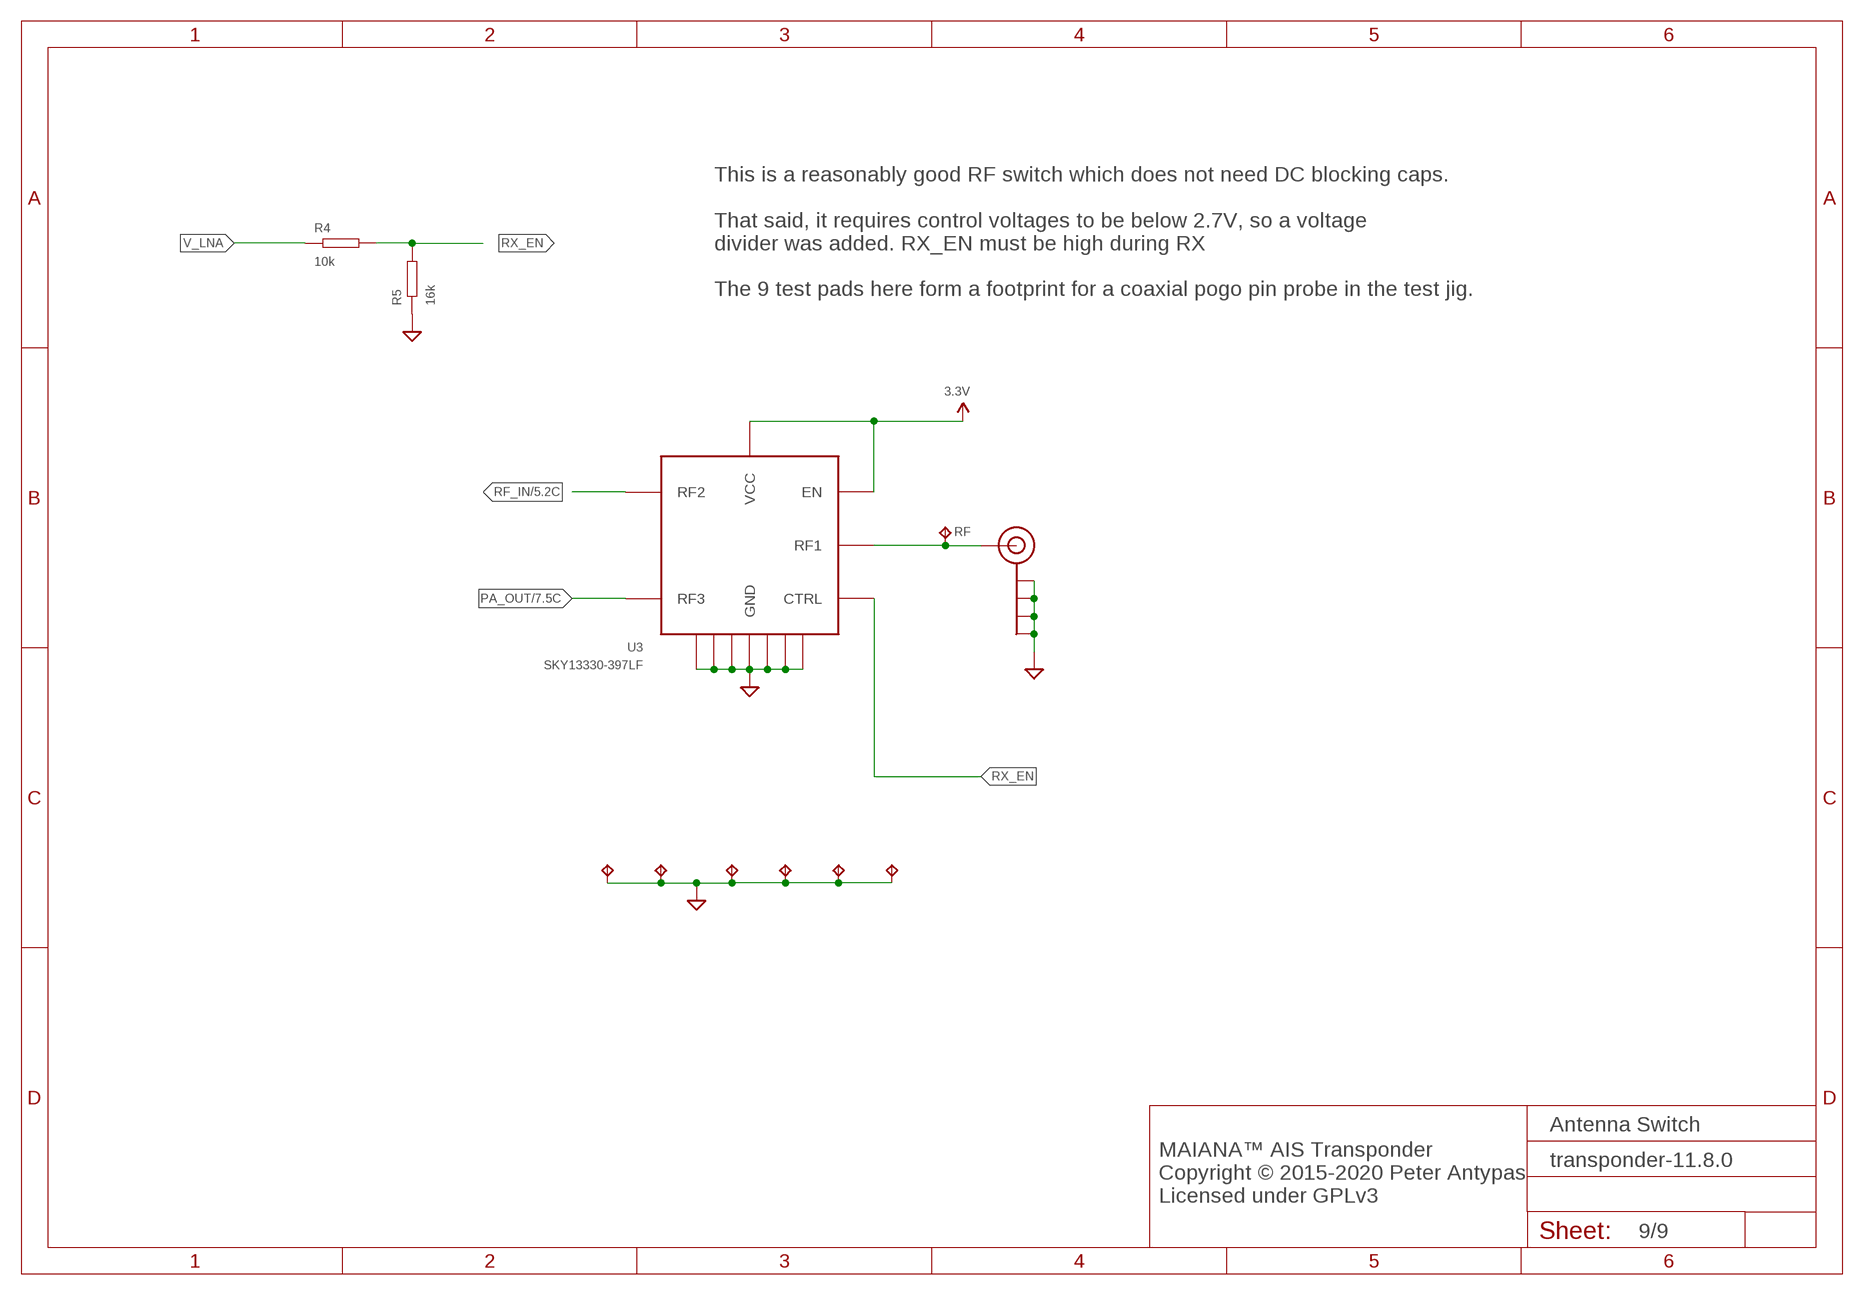
[diagram p8: schematic, sheet 9]

### Parts
J$1  SMA_EDGE  [SMA-EDGE]  (not fitted in variant Regulator)  (not fitted in variant Zener)  (not fitted in variant SMT Stencil)
R4  10k  RESISTOR0603  [0603]
R5  16k  RESISTOR0603  [0603]
RF  TPTP10R  [TP10R]
SWDIO1  TPTP12R  [TP12R]
SWDIO2  TPTP12R  [TP12R]
SWDIO3  TPTP12R  [TP12R]
SWDIO4  TPTP12R  [TP12R]
SWDIO5  TPTP12R  [TP12R]
SWDIO6  TPTP12R  [TP12R]
U3  SKY13330-397LF  SKYWORKS-13330397LF  [QFN12]

### Nets
3.3V: U3.P$8(EN) U3.P$9(VCC) ; also sheet 2,3,4,5,6,8
GND: J$1.GND@0(GND) J$1.GND@1(GND) J$1.GND@2(GND) J$1.GND@3(GND) R5.P$1 SWDIO1.TP SWDIO2.TP SWDIO3.TP SWDIO4.TP SWDIO5.TP SWDIO6.TP U3.P$1(GND) U3.P$3(GND) U3.P$4(GND) U3.P$6(GND) U3.P$10(GND) U3.P$12(GND) U3.P$13(GND) ; also sheet 1,2,3,4,5,6,7,8
N$15: J$1.SIG(SIGNAL) RF.TP U3.P$2(RF1)
PA_OUT: U3.P$5(RF3) ; also sheet 7
RF_IN: U3.P$11(RF2) ; also sheet 5
RX_EN: R4.P$2 R5.P$2 U3.P$7(CTRL)
V_LNA: R4.P$1 ; also sheet 5

### Notes on the sheet
- This is a reasonably good RF switch which does not need DC blocking caps.
  
  That said, it requires control voltages to be below 2.7V, so a voltage
  divider was added. RX_EN must be high during RX
  
  The 9 test pads here form a footprint for a coaxial pogo pin probe in the test jig.
- Antenna Switch
- MAIANA™ AIS Transponder
  Copyright © 2015-2020 Peter Antypas
  Licensed under GPLv3

## Library data of the parts
3V3 BOOT0 GND1 GND2 NRST RF RX SWCLK SWDIO SWDIO1-SWDIO6 TX V_IN V_LNA V_PA = testpad:TP: Test pad; DNP: T
C1 = MyPassives:CAPACITOR: Standard SMD capacitor; PARTNO: EMK212ABJ106KG-T
C2 C5 C11 C13 C14 C16 = MyPassives:CAPACITOR: Standard SMD capacitor; PARTNO: CL10B223KA8NNNC
C3 C32 C34 C47 C49 = MyPassives:CAPACITOR: Standard SMD capacitor; PARTNO: 0603X225K160CT
C4 C26 C28 C43 = MyPassives:CAPACITOR: Standard SMD capacitor; PARTNO: 0603B104K250CT
C6 = MyPassives:CAPACITOR: Standard SMD capacitor; PARTNO: CL21A226KOQNNNE
C7 C21 = MyPassives:CAPACITOR: Standard SMD capacitor; PARTNO: 0603B471K500CT
C8 C15 C17 = MyPassives:CAPACITOR: Standard SMD capacitor; PARTNO: CC0603JRNPO9BN910
C9 C10 = MyPassives:CAPACITOR: Standard SMD capacitor; PARTNO: 0603N3R3B500CT
C12 C18 C29 C44 = MyPassives:CAPACITOR: Standard SMD capacitor; PARTNO: 0603N222J500CT
C22 C42 = MyPassives:CAPACITOR: Standard SMD capacitor; PARTNO: CL10C200JB8NNNC
C23 = MyPassives:CAPACITOR: Standard SMD capacitor; PARTNO: 0603N160G500CT
C30 C37 = MyPassives:CAPACITOR: Standard SMD capacitor; PARTNO: 0603N470J500LT
C36 = MyPassives:CAPACITOR: Standard SMD capacitor; PARTNO: 0603N390J500CT
C39 = MyPassives:CAPACITOR: Standard SMD capacitor; PARTNO: 0603N560J500CT
C52 C53 = MyPassives:CAPACITOR: Standard SMD capacitor; PARTNO: 0603N360J500CT
D1 = MyDiodes:DIODE-ZENER: Zener Diode; PARTNO: BZX384-B9V1
D4 = MyDiodes:DIODE-SCHOTTKY: Standard SMD Schottky diode; PARTNO: SBA130CS_R1_00001
J$1 = SparkFun-Connectors:SMA_EDGE: SMA Antenna Connector End launch SMA connector. The paste layer has been removed so that the connector can be hand soldered onto the board after reflow.; DNP: T
JLINK = SparkFun-Connectors:M05: Header 5 Standard 5-pin 0.1" header. Use with straight break away headers (SKU : PRT-00116), right angle break away headers (PRT-00553), swiss pins (PRT-00743), machine pins (PRT-00117), and female headers (PRT-00115). Molex polarized connector foot print use with SKU : PRT-08230 with associated crimp pins and housings.; DNP: T
JP1 = SparkFun-Connectors:RJ45-8: RJ45 Jack Simple RJ45, 8-pin connection - connector for common Cat5, Cat5e, and Cat6 Ethernet cables. Footprint not yet proven in production. Connector sku is PRT-00643; Breakout PCB sku is BOB-00716.; PARTNO: 95501-2821; PROD_ID: CONN-08506; VALUE: RJ45
L1 = MyPassives:INDUCTOR: Standard SMD inductor; PARTNO: LQW18AN47NG00D
L2 L12 = MyPassives:INDUCTOR: Standard SMD inductor; PARTNO: CMP201209UD4R7MT
L3 = MyPassives:INDUCTOR: Standard SMD inductor; PARTNO: LQW18AN36NG00D
L4 = MyPassives:INDUCTOR: Standard SMD inductor; PARTNO: LQM21PN2R2MGSD
L5 L17 = MyPassives:INDUCTOR: Standard SMD inductor; PARTNO: HBLS1608-R47J
L6 = MyPassives:INDUCTOR: Standard SMD inductor; PARTNO: LQW18AN68NG00D
L8 L13 = MyPassives:INDUCTOR: Standard SMD inductor; PARTNO: LQW18ANR27G00D
L9 = MyPassives:INDUCTOR: Standard SMD inductor; PARTNO: LQW18AN18NG00D
L10 = MyPassives:INDUCTOR: Standard SMD inductor; PARTNO: LQW18AN22NJ00D
L14 = MyPassives:INDUCTOR: Standard SMD inductor; PARTNO: LQW18AN10NG00D
L23 = MyPassives:INDUCTOR: Standard SMD inductor; PARTNO: LQW18AN39NG00D
Q1 Q2 = transistor-small-signal:BSS84: P-CHANNEL MOS FET; PARTNO: PJM3415PSA
Q3 = SparkFun-DiscreteSemi:TRANSISTOR_NPN: Generic NPN BJT MMBT2222A - TRANS-08049 (SOT-23, 1A 40V) MPSA42 - TRANS-09116 (SOT-23, 500mA 300V) MMBT5088LT1G - TRANS-11160 (SOT-23, 50 mA 30V) BC547 - COM-08928 <http://www.sparkfun.com/products/8928> (TO-92 45V 100mA) (1.Collector 2.Base 3.Emitter) 2N3904 - COM-00521 <http://www.sparkfun.com/products/521> (TO-92 40V 200mA) (1.Emitter 2.Base 3.Collector) P2N2222A - COM-12852 <http://www.sparkfun.com/products/12852> (TO-92 40V 600mA) (1.Collector 2.Base 3.Emitter); PARTNO: DSS20201L-7; PROD_ID: TRANS-08049
R1 R4 R6 R12 R18 R23 = MyPassives:RESISTOR: Standard SMD resistor; PARTNO: CR0603JA0103G
R2 R3 R7 R13 = MyPassives:RESISTOR: Standard SMD resistor; PARTNO: CR0603JA0112G
R5 R24 = MyPassives:RESISTOR: Standard SMD resistor; PARTNO: RC0603FR-0716KL
R10 = MyPassives:RESISTOR: Standard SMD resistor; PARTNO: CR0603FA2200G
R11 = MyPassives:RESISTOR: Standard SMD resistor; PARTNO: RC0603FR-072K2L
R14 R15 R17 = MyPassives:RESISTOR: Standard SMD resistor; PARTNO: RMC1/16K101FTP
R21 = MyPassives:RESISTOR: Standard SMD resistor; PARTNO: CR0603FA5102G
R22 = MyPassives:RESISTOR: Standard SMD resistor; PARTNO: RC0603JR-0722RL
S1 = c&k-switch:KMR221NGLFS: Miniature tactile switch, 4-lead SMD; DNP: T; PARTNO: KMR221NGLFS
U1 = diodesinc:AP3211; PARTNO: AP3211KTR-G1
U2 = quectel:L70: GPS Module; PARTNO: L76L-M33
U3 = skyworks:SKYWORKS-13330397LF: SP2T RF Switch; PARTNO: SKY13330-397LF
U4 = st-power:LDFPVR: 1A Adjustable LDO; PARTNO: LDFPVR
U5 = nxp:BGA2870: MMIC Wideband Amplifier; PARTNO: BGA2800,115
U6 = diodesinc:AZ23C3V6-7-F: Common Anode Zener Diode, 3.6V; PARTNO: AZ23C3V6-7-F
U7 = nxp:AFT0SMS003N; PARTNO: AFT05MS003NT1
U9 = diodesinc:D3V3X8U9LP3810: 8 CHANNEL LOW CAPACITANCE TVS DIODE ARRAY; PARTNO: D3V3X8U9LP3810
U10 = johanson-technology:1575AT43A0040E: SMD Ceramic GNSS Antenna; PARTNO: 1575AT43A0040E
U11 U12 = EZRadioPRO:SI4463; PARTNO: SI4460-C2A-GM
U13 = stm32:STM32L432KXXX; PARTNO: STM32L432KBU6
U14 U17 = diodesinc:DMN63D8LDW: Dual N-Channel MOSFET; PARTNO: SI1926DL-T1-E3
U15 = eeprom:24LC01B: 1KB I2C EEPROM; PARTNO: 24LC01BT/OT
U$1-U$3 = adafruit:FIDUCIAL: For use by pick and place machines to calibrate the vision/machine, 1mm By microbuilder.eu; BOM: EXCLUDE
X1 X2 = adafruit:XTAL-4: Classic 4-pin 3.2 x 2.5mm crystal; PARTNO: ECS-300-10-33B-CKM-TR
Z1 = MyPassives:RESISTOR: Standard SMD resistor; PARTNO: LQW18AN5N6C00D
Z2 = MyPassives:RESISTOR: Standard SMD resistor; PARTNO: 0603N2R2B500CT
Z3 = MyPassives:RESISTOR: Standard SMD resistor; PARTNO: RF18N4R0B500CT

## Board
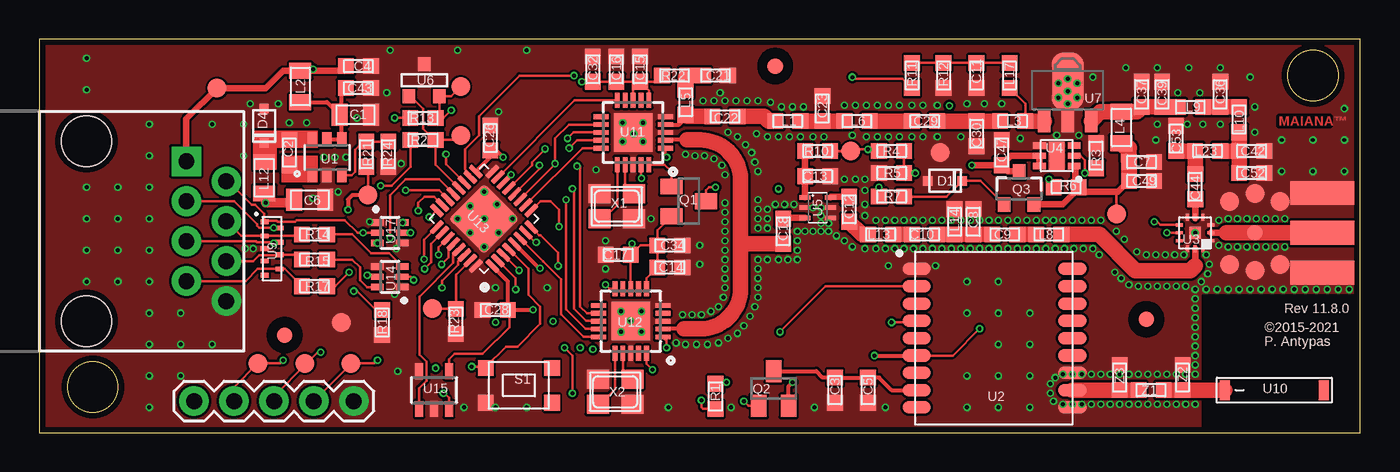
[diagram p9: board, top side]
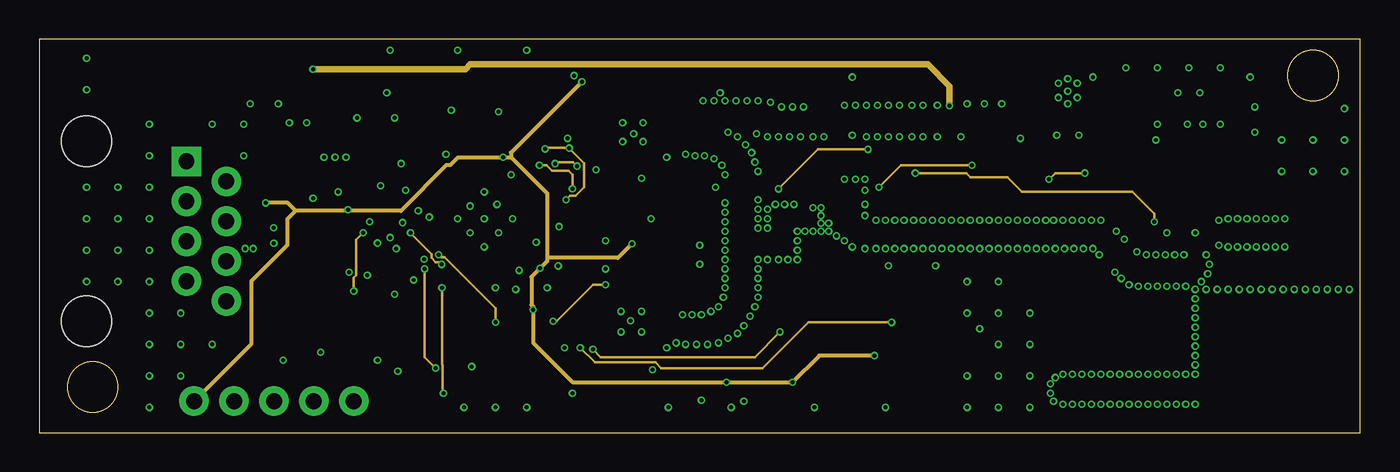
[diagram p10: board, inner layer Layer2]
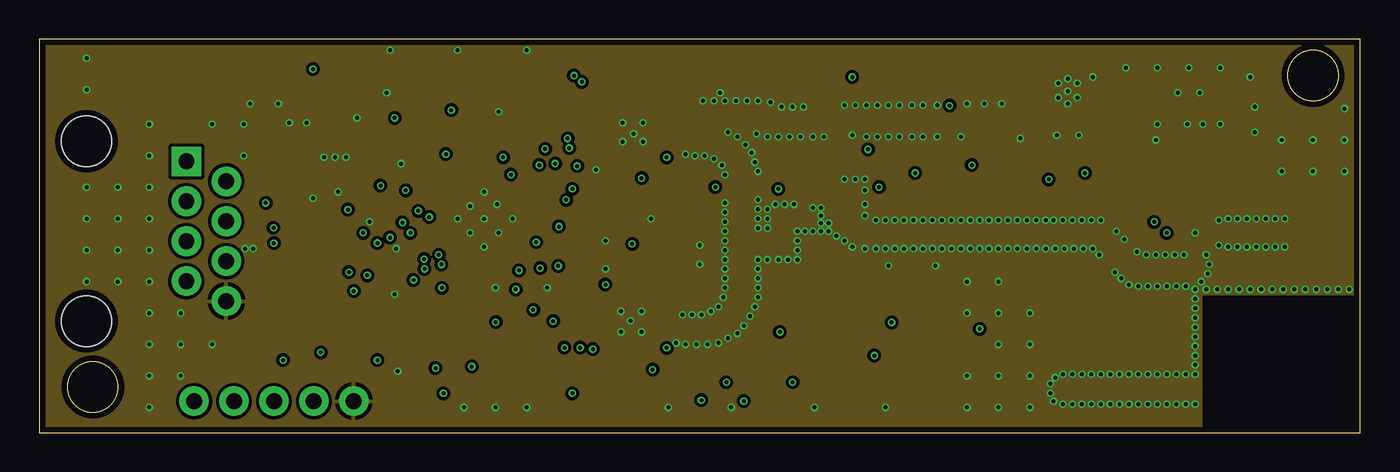
[diagram p11: board, inner layer Layer3]
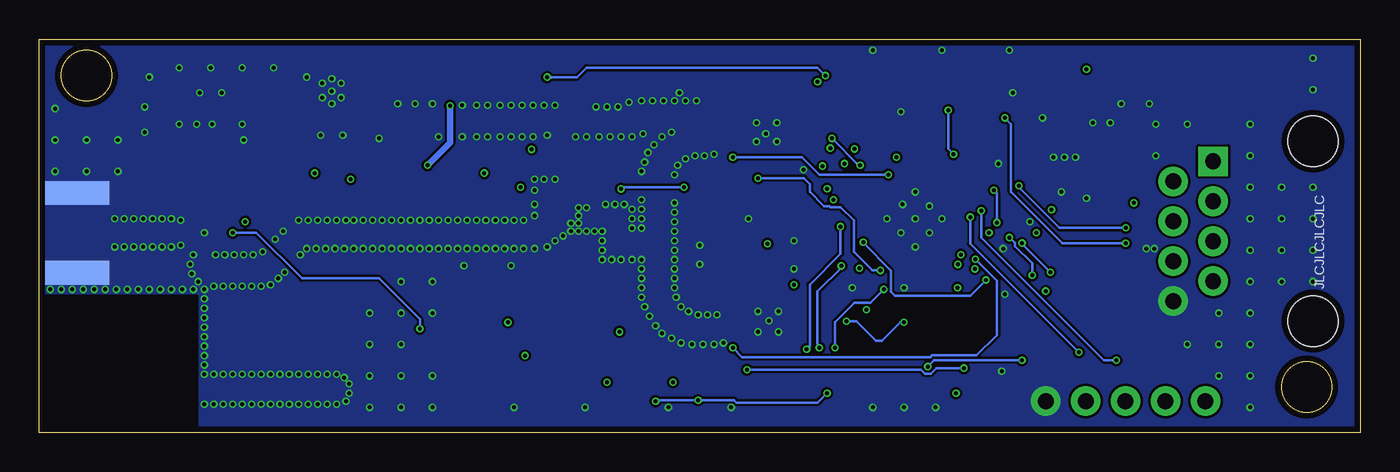
[diagram p12: board, bottom side, seen from below]

Size 84 x 25 mm. Coordinates in mm from the lower left corner, seen from the top.
Outline: 0,0 84,0 84,25 0,25 0,0
Outline: circle at 81,22.7 radius 1.6
Outline: circle at 3.4,2.9 radius 1.6
Copper layers (1+2*15+16): Top 0.035mm / dielectric 0.17mm / Layer2 0.018mm / dielectric 1.2mm / Layer3 0.018mm / dielectric 0.17mm / Bottom 0.035mm
Design rules "default *": minimum track width 5mil, minimum drill 10mil, track to track 6mil, track to pad 6mil, pad to pad 6mil, via to via 6mil, smd to smd 0mil, copper to edge 15mil, drill to drill 6mil, minimum pad ring 4mil, minimum via ring 4mil, stop-mask expansion 0mil, vias tented up to drill 20mil, thermal gap 10mil
tRestrict: area 74,0 to 84,8.7
bRestrict: area 74,0 to 84,8.7

### Footprints (pad centres in the part's own frame; a part is rotated, then mirrored left to right if it is on the bottom)
TP12R = smd 1.2 x 1.2: TP 0,0
0805 = smd 1 x 1.4: P$1 -1,0; P$2 1,0
0603 = smd 1 x 1: P$1 -0.8,0; P$2 0.8,0
SOD323 = smd 0.6 x 0.6: A 1.1,0; C -1.1,0
SMA-EDGE = smd 1.524 x 4.064: GND@0 0,0; GND@1 5.08,0; SIG 2.54,0 | smd 1.524 x 4.064 bottom: GND@2 0,0; GND@3 5.08,0
1X05 = drill 1.016 pad 1.88: 1 0,0; 2 2.54,0; 3 5.08,0; 4 7.62,0; 5 10.16,0
RJ45-8 = drill 1 pad 1.88 square: 1 -4.445,6.35 | drill 1 pad 1.88: 2 -3.175,8.89; 3 -1.905,6.35; 4 -0.635,8.89; 5 0.635,6.35; 6 1.905,8.89; 7 3.175,6.35; 8 4.445,8.89 | hole 3.2: -5.715,0; 5.715,0
SOT23 = smd 1 x 1.4: 1 -0.95,-1.1; 2 0.95,-1.1; 3 0,1.1
SOT23-3 = smd 0.8 x 0.9: 1 -0.95,-1; 2 0.95,-1; 3 0,1.1
TP10R = smd 1 x 1: TP 0,0
KMR221NGLFS = smd 1 x 1: P$1 -2.1,1.1; P$2 -2.1,-1.1; P$3 2.1,-1.1; P$4 2.1,1.1
SOT23-6 = smd 0.6 x 0.9: 1 -0.95,-1.15; 2 0,-1.15; 3 0.95,-1.15; 4 0.95,1.15; 5 0,1.15; 6 -0.95,1.15
GPS_MODULE = smd 1.8 x 0.8: P$1 -4.9,4.4; P$2 -4.9,3.3; P$3 -4.9,2.2; P$4 -4.9,1.1; P$5 -4.9,0; P$6 -4.9,-1.1; P$7 -4.9,-2.2; P$8 -4.9,-3.3; P$9 -4.9,-4.4; P$10 5,-4.4; P$11 5,-3.3; P$12 5,-2.2; P$13 5,-1.1; P$14 5,0; P$15 5,1.1; P$16 5,2.2; P$17 5,3.3; P$18 5,4.4
QFN12 = smd 0.44 x 0.2: P$1 -1,0.5; P$2 -1,0; P$3 -1,-0.5; P$7 1,-0.5; P$8 1,0; P$9 1,0.5 | smd 0.2 x 0.44: P$4 -0.5,-1; P$5 0,-1; P$6 0.5,-1; P$10 0.5,1; P$11 0,1; P$12 -0.5,1 | smd 0.76 x 0.76: P$13 0,0
DFN6-2X2 = smd 0.8 x 0.4: P$1 -1.1,0.65; P$2 -1.1,0; P$3 -1.1,-0.65; P$4 1.1,-0.65; P$5 1.1,0; P$6 1.1,0.65 | smd 1 x 1.8: P$7 0,0
SOT363 = smd 0.3 x 0.7: 1 -0.65,-0.8; 2 0,-0.8; 3 0.65,-0.8; 4 0.65,0.8; 5 0,0.8; 6 -0.65,0.8
SOT-23 = smd 0.787 x 0.889: 1 -0.991,-1.016; 2 0.94,-1.016; 3 -0.025,1.016
SOT-89 = smd 0.8 x 1.4: 1 -1.499,-1.981; 3 1.499,-1.981 | smd 0.8 x 1.9: 2 0,-1.727 | smd 2.032 x 3.65: 2@1 0,0.54
U-DFN3810-9(B) = smd 0.3 x 0.5: P$1 -1.7,-0.48; P$2 -0.8,-0.48; P$3 0,-0.48; P$4 0.8,-0.48; P$5 1.7,-0.48; P$6 1.3,0.48; P$7 0.4,0.48; P$8 -0.4,0.48; P$9 -1.3,0.48
1575AT43A0040E = smd 0.635 x 1.27: P$1 -3.2,0; P$2 3.1,0
QFN20 = smd 0.95 x 0.3: 1 -2.05,1; 2 -2.05,0.5; 3 -2.05,0; 4 -2.05,-0.5; 5 -2.05,-1; 11 2.05,-1; 12 2.05,-0.5; 13 2.05,0; 14 2.05,0.5; 15 2.05,1 | smd 0.3 x 0.95: 6 -1,-2.05; 7 -0.5,-2.05; 8 0,-2.05; 9 0.5,-2.05; 10 1,-2.05; 16 1,2.05; 17 0.5,2.05; 18 0,2.05; 19 -0.5,2.05; 20 -1,2.05 | smd 2.45 x 2.45: EXP 0,0
QFN32 = smd 1 x 0.3: 1 -2.5,1.75; 2 -2.5,1.25; 3 -2.5,0.75; 4 -2.5,0.25; 5 -2.5,-0.25; 6 -2.5,-0.75; 7 -2.5,-1.25; 8 -2.5,-1.75; 17 2.5,-1.75; 18 2.5,-1.25; 19 2.5,-0.75; 20 2.5,-0.25; 21 2.5,0.25; 22 2.5,0.75; 23 2.5,1.25; 24 2.5,1.75 | smd 0.3 x 1: 9 -1.75,-2.5; 10 -1.25,-2.5; 11 -0.75,-2.5; 12 -0.25,-2.5; 13 0.25,-2.5; 14 0.75,-2.5; 15 1.25,-2.5; 16 1.75,-2.5; 25 1.75,2.5; 26 1.25,2.5; 27 0.75,2.5; 28 0.25,2.5; 29 -0.25,2.5; 30 -0.75,2.5; 31 -1.25,2.5; 32 -1.75,2.5 | smd 3.2 x 3.2: EXP 0,0
SOT363' = smd 0.4 x 0.8: 1 -0.65,-0.8; 2 0,-0.8; 3 0.65,-0.8; 4 0.65,0.8; 5 0,0.8; 6 -0.65,0.8
SOT23-5 = smd 0.5 x 1: 1 -0.95,-1.2; 2 0,-1.2; 3 0.95,-1.2; 4 0.95,1.2; 5 -0.95,1.2
FIDUCIAL_1MM = smd 1 x 1: 1 0,0
NX3225 = smd 1.4 x 1.2: 1 -1.1,-0.8; 2 1.1,-0.8; 3 1.1,0.8; 4 -1.1,0.8

### Placement (x,y rotation side)
3V3  20.9,15.1 0 top
BOOT0  25,7.9 0 top
C1  20.1,20.2 0 top
C2  15.9,17.8 90 top
C3  50.6,2.7 270 top
C4  20.3,23.3 0 top
C5  52.7,2.7 270 top
C6  17.2,14.8 0 top
C7  70.1,17.2 0 top
C8  59.4,13.4 90 top
C9  61.4,12.6 180 top
C10  56.3,12.6 180 top
C11  59.6,22.7 270 top
C12  51.5,14.2 90 top
C13  49.5,16.3 0 top
C14  40.1,10.5 0 top
C15  38.2,23.1 90 top
C16  36.7,23.1 90 top
C17  36.82,11.3 180 top
C18  47.3,12.8 270 top
C21  43,22.7 0 top
C22  43.6,20.1 0 top
C23  49.8,20.6 90 top
C26  28.69,18.73 90 top
C28  28.99,7.79 180 top
C29  56.3,19.8 0 top
C30  59.6,19 270 top
C32  35.2,23.1 90 top
C34  40.1,11.9 0 top
C36  75.1,21.5 90 top
C37  70.1,21.5 90 top
C39  71.4,21.5 90 top
C42  77.1,17.9 0 top
C43  20.3,21.9 0 top
C44  73.51,15.63 270 top
C47  61.2,17.8 90 top
C49  70.1,16 0 top
C52  77.1,16.5 0 top
C53  72.3,18.7 90 top
D1  57.6,16 180 top
D4  14.3,19.5 90 top
GND1  57.3,17.8 0 top
GND2  19.2,7 0 top
J$1  81.6,10.15 90 top  (not fitted)
JLINK  20,2 180 top  (not fitted)
JP1  3,12.8 270 top  (not fitted)
L1  47.6,19.8 0 top
L2  16.6,22 270 top
L3  61.9,19.8 0 top
L4  68.81,19.39 90 top
L5  41.1,21 270 top
L6  52,19.8 0 top
L8  64.2,12.6 180 top
L9  73.2,20.7 0 top
L10  76.3,19.9 270 top
L12  14.3,16.2 270 top
L13  53.5,12.6 180 top
L14  58.2,13.4 270 top
L17  61.7,22.7 90 top
L23  74.3,17.9 180 top
NRST  19.8,4.4 0 top
Q1  41.3,14.7 270 top
Q2  46.7,2.8 0 top
Q3  62.3,15.5 0 top
R1  43,2.3 90 top
R2  24.4,18.6 180 top
R3  67.2,17.6 270 top  (not fitted)
R4  54.2,17.9 0 top
R5  54.2,16.5 0 top
R6  65.3,15.6 0 top  (not fitted)
R7  54.2,15 180 top
R10  49.5,17.9 180 top
R11  55.5,22.7 270 top
R12  57.5,22.7 90 top
R13  24.4,20 180 top
R14  17.5,12.6 180 top
R15  17.5,11 180 top
R17  17.5,9.3 180 top
R18  21.8,7 90 top
R21  20.8,17.7 270 top
R22  40.4,22.7 180 top
R23  26.49,7.06 270 top
R24  22.2,17.7 90 top
RF  77.3,12.7 0 top
RX  26.8,18.9 0 top
S1  30.5,3 0 top  (not fitted)
SWCLK  16.9,4.4 0 top
SWDIO  13.9,4.4 0 top
SWDIO1  78.9,14.7 0 top
SWDIO2  78.9,10.7 0 top
SWDIO3  75.7,14.7 0 top
SWDIO4  75.7,10.7 0 top
SWDIO5  77.3,15.2 0 top
SWDIO6  77.3,10.3 0 top
TX  26.8,22 0 top
U1  18.3,17.5 0 top
U2  60.7,6 0 top
U3  73.5,12.7 180 top
U4  64.7,17.6 180 top  (not fitted)
U5  49.5,14.3 270 top
U6  24.5,22.4 0 top
U7  65.4,21.78 0 top
U9  14.8,11.7 270 top
U10  78.59,2.7 0 top
U11  37.76,19.08 180 top
U12  37.61,7.08 180 top
U13  28.28,13.59 135 top
U14  SI1926DL-T1-E3  [SOT363']  22.3,9.9 90 top
U15  25.1,2.7 0 top
U17  SI1926DL-T1-E3  [SOT363']  22.3,12.7 270 top
U$1  15.6,6.2 0 top
U$2  70.4,7.2 0 top
U$3  46.8,23.3 0 top
V_IN  11.3,21.9 0 top
V_LNA  51.6,17.9 0 top
V_PA  68.5,13.9 0 top
X1  36.73,14.39 0 top
X2  36.62,2.59 0 top
Z1  70.7,2.7 180 top
Z2  72.7,3.5 270 top
Z3  68.7,3.5 270 top

### Tracks (layer width: path | path; a pad name or v marks a point on that pad's centre or on a via)
3.3V  (via drill 0.25)
  Top 0.152: U12.6 38.61,9.81 C14.P$1 C34.P$1 | U12.8 C17.P$1 38.22,11.9 C34.P$1 | U2.P$6 58.1,4.9 v59.8,6.6 | C34.P$1 39.3,12.85 Q1.2 | U15.4 26.05,4.65 26.4,5 28.2,5 29.9,6.7 29.9,7.8 | R1.P$2 43.1,3.2 v43.7,3.2 | v71.7,12.7 U3.P$8 U3.P$9 | R21.P$2 20.9,16.8 3V3.TP | C32.P$1 C16.P$1 C15.P$1 | C15.P$1 37.76,21.86 U11.8 | C15.P$1 38.76,21.74 U11.6 | C15.P$1 39.2,22.3 R22.P$2
  Top 0.254: v29.5,17.5 29.07,17.93 C26.P$1 28.69,17.54 U13.17 | U13.5 31.77,10.45 v31.85,10.45 | U13.1 29.79,9.61 C28.P$1 29.9,7.8 v31.4,7.8 | C32.P$1 v34.5,22.3 | C17.P$1 37.62,11.92 v37.7,12 | 3V3.TP 19.9,15.1 19.63,14.83 v19.63,14.17 | v53.1,4.9 U2.P$6 | Q2.2 47.65,2.95 v47.9,3.2
  Top 0.406: L12.P$2 14.3,14.7 v14.4,14.6
  Top 0.61: C6.P$1 16,14.6 v14.4,14.6
  Layer2 0.254: 30,17.5 v29.5,17.5 26.63,17.5 26.14,17.01 25.91,17.01 23,14.1 19.7,14.1 | 30,17.5 32.3,15.2 32.3,11.1 | 32.3,11.1 32.3,10.9 v31.85,10.45 31.3,9.9 31.3,8.1 31.4,8 v31.4,7.8 31.4,5.7 33.9,3.2 v43.7,3.2 v47.9,3.2 49.6,4.9 v53.1,4.9 | v34.5,22.3 30,17.8 30,17.5 | JLINK.5 13.5,5.66 13.5,9.64 15.79,11.93 15.79,13.59 16.3,14.1 | v37.7,12 36.8,11.1 32.3,11.1 | 19.7,14.1 16.3,14.1 | v14.4,14.6 15.8,14.6 16.3,14.1 | v19.63,14.17 19.7,14.1
  Bottom 0.152: v59.8,6.6 59.8,7.2 62.4,9.8 67.3,9.8 70.2,12.7 v71.7,12.7
BOOT0
  Top 0.152: U13.31 26.49,10.03 R23.P$1 25.04,7.86 BOOT0.TP
CS1
  Top 0.152: U13.10 34.54,18.08 U11.15
CS2
  Top 0.152: U12.15 35.54,6.1 34.6,6.1 33.2,7.51 33.2,9.75 32.04,10.91 32.02,10.91 U13.6
GND  (via drill 0.25)
  other vias: 13.6,11.7 13.1,11.7 22.6,8.8 22.8,3.9 22.7,11.7 21,13.4 29.2,20.4 83.3,9.1 82.6,9.1 81.9,9.1 81.2,9.1 80.5,9.1 79.8,9.1 79.1,9.1 78.4,9.1 77.7,9.1 77,9.1 76.3,9.1 75.6,9.1 74.9,9.1 74.2,9.1 73.5,9.1 73.5,8.5 73.5,7.9 73.5,7.3 73.5,6.7 73.5,6.1 73.5,5.5 73.5,4.9 73.5,4.3 73.5,3.7 73.5,1.8 72.9,1.8 72.3,1.8 71.7,1.8 71.1,1.8 70.5,1.8 69.9,1.8 69.3,1.8 68.7,1.8 68.1,1.8 67.5,1.8 66.9,1.8 72.9,3.7 72.3,3.7 71.7,3.7 71.1,3.7 70.5,3.7 69.9,3.7 69.3,3.7 68.7,3.7 68.1,3.7 67.5,3.7 66.9,3.7 79.2,11.8 78.6,11.8 78,11.8 77.4,11.8 76.8,11.8 76.2,11.8 75.6,11.8 75,11.9 75.6,13.6 75,13.5 76.2,13.6 76.8,13.6 77.4,13.6 78,13.6 78.6,13.6 79.2,13.6 66.4,11.7 65.8,11.7 65.2,11.7 64.6,11.7 66.3,13.5 64.5,13.5 66.9,13.5 67.5,13.5 65.7,13.5 65.1,13.5 64,11.7 63.4,11.7 62.8,11.7 62.2,11.7 61.6,11.7 61,11.7 60.4,11.7 59.8,11.7 59.2,11.7 58.6,11.7 58,11.7 57.4,11.7 56.8,11.7 56.2,11.7 55.6,11.7 55,11.7 54.4,11.7 53.8,11.7 53.2,11.7 51.7,11.8 51.2,12.2 50.7,12.5 49.7,14.3 49.7,13.8 49.7,13.3 50.2,13.3 49.2,14.3 53.2,13.5 53.8,13.5 54.4,13.5 55,13.5 55.6,13.5 56.2,13.5 56.8,13.5 57.4,13.5 58,13.5 58.6,13.5 59.2,13.5 59.8,13.5 60.4,13.5 61,13.5 61.6,13.5 62.2,13.5 62.8,13.5 63.4,13.5 64,13.5 64.6,3.5 64.3,3.1 64.3,2.5 66.3,3.7 65.7,3.7 65.1,3.7 66.3,1.8 65.7,1.8 65.1,1.8 64.5,2 48,14.5 47.4,14.5 46.8,14.5 46.3,13 45.7,13 45.7,13.6 45.7,14.2 45.7,14.8 45.7,16.6 45.5,17.2 45.3,17.8 44.9,18.3 44.4,18.8 43.8,19.1 45.7,11 45.7,10.4 45.5,8 45.2,7.4 44.8,6.8 44.4,6.3 43.8,6 43.2,5.7 42.5,5.6 41.8,5.6 41.1,5.6 40.5,5.7 43.6,11 43.6,10.4 43.2,8 42.7,7.7 42.1,7.5 41.5,7.5 40.9,7.5 43.6,11.6 43.6,12.2 43.6,12.8 43.6,13.4 43.6,14 43.6,14.6 43.6,16.4 43.4,17 42.9,17.4 42.3,17.6 41.7,17.6 41.1,17.7 46.3,11 47,11 47.6,11 48.2,11 48.2,11.6 48.2,12.2 48.2,12.8 49.7,12.8 49.2,12.8 50.2,12.8 48.7,12.8 51.2,16.1 51.9,16.1 52.5,15.4 83,16.6 83,18.6 83,20.6 81,18.6 81,16.6 79,16.6 79,18.6 77.3,19.1 77.3,20.7 77,22.6 75.1,23.2 73.1,23.2 71.1,23.2 69.1,23.2 67,22.6 71,18.6 75.1,19.6 63,1.6 61,1.6 59,1.6 59,3.6 61,3.6 63,3.6 63,5.6 61,5.6 63,7.6 61,7.6 59,7.6 59,9.6 61,9.6 57,10.6 54,10.6 44,1.6 40,1.6 7,1.6 7,3.6 7,5.6 7,7.6 7,9.6 7,11.6 7,13.6 7,15.6 7,17.6 7,19.6 5,15.6 5,13.6 5,11.6 5,9.6 3,11.6 3,13.6 3,15.6 3,9.6 9,5.6 3,21.8 3,23.8 11,5.6 9,3.6 9,7.6 11,19.6 13,19.6 13,17.6 22.1,21.6 43.6,9.8 45.7,9.8 54.7,20.8 56.2,20.8 57.1,20.8 60.1,20.9 61.2,20.9 65.4,22.5 64.8,22.2 66,22.2 65.4,21.7 64.8,21.3 66,21.3 65.4,20.9 54,18.8 53.3,18.8 26.6,13.6 27.4,14.4 28.3,15.3 29.1,14.5 30.1,13.6 27.4,12.7 28.3,11.8 29.2,12.7 28.3,13.6 37.1,19.7 37.1,18.5 38.4,18.5 38.4,19.7 37.8,19 37,7.7 38.3,7.7 38.3,6.4 37,6.4 37.6,7.1 43.3,21.6 31,24.3 26.6,24.3 22.3,24.3 29,9.2 32.3,9.2 31,1.6 29,1.6 27,1.6 45.7,9.2 43.6,9.2 43.5,8.6 45.7,8.6 42,11.9 42,10.7 38.9,13.6 35.4,16.7 36,12.2 36,10.4 46.3,13.6 46.3,14.2 59,20.9 18.1,17.5 18.8,17.5 19.5,17.5 13.4,20.9 15.9,19.7 17,19.7 20.2,20 19,15.3 17.4,14.9 56.2,18.8 57.1,18.8 62.4,18.7 64.7,18.9 52.5,11.7 52.5,14.5 52.5,13.8 52.5,16.1 42.2,21.1 42.9,21.1 43.6,21.1 44.3,21.1 45,21.1 45.7,21.1 46.5,21 47.2,20.7 47.9,20.7 48.6,20.7 54,20.8 53.3,20.8 52.6,20.8 51.9,20.8 51.2,20.8 54.7,18.8 55.5,18.8 55.5,20.8 52.6,18.8 45.6,19 46.3,18.8 47,18.8 47.7,18.8 48.4,18.8 49.2,18.8 49.9,18.8 51.7,18.9 58.6,18.8 67,11.7 53.8,1.6 49.3,1.6 66.1,18.9 71.1,19.6 73,19.6 74,19.6 72.4,21.6 73.8,21.6 15.2,20.9 67.4,11.3 68.4,10.2 68.8,9.8 69.3,9.4 69.9,9.3 70.5,9.3 71.1,9.3 71.7,9.3 73.9,9.6 74.3,10.1 68.5,12.8 69,12.3 69.8,11.5 70.4,11.3 71,11.3 71.6,11.3 72.2,11.3 72.3,9.3 74.4,10.7 74.2,11.3 72.8,11.3 72.9,9.3 73.5,12.7 23,17.1
  pour Top (isolate 0.1, no thermals): -0.9,25.8 86.3,25.8 86.3,-1.1 -0.9,-1.1
  pour Bottom (isolate 0.1, no thermals): -3,28.6 87,28.6 87,-2.4 -3,-2.4
  pour Layer3 (isolate 0.2): -1.6,27.6 85.3,27.6 85.3,8.8 73.9,8.8 73.9,-1.8 -1.6,-1.8
GPS_1PPS  (via drill 0.25)
  Top 0.152: U13.8 31.79,12.56 31.89,12.56 33,11.45 v33,10.59 | v54.2,7 55.7,7 U2.P$4
  Layer2 0.152: v34.4,5.4 35.34,4.46 39.19,4.46 39.55,4.1 46,4.1 48.9,7 v54.2,7
  Bottom 0.152: v33,10.59 33,10.49 34.5,8.99 34.5,5.5 v34.4,5.4
GPS_EN  (via drill 0.25)
  Top 0.152: U13.2 30.3,9.8 v30.3,9.1 | v33.4,5.4 33.9,4.9 v33.9,2.5 | Q2.1 45.1,1.7 v44.8,2 | R1.P$1 42.2,1.5 42.1,1.6 v42.1,2.06
  Bottom 0.152: v33.4,5.4 33.4,7.01 32.15,8.26 31.14,8.26 v30.3,9.1 | v33.9,2.5 34.5,1.9 39.65,1.9 39.81,2.06 v42.1,2.06 44.74,2.06 v44.8,2
GPS_STATUS  (via drill 0.25)
  Top 0.152: U13.21 25.42,16.09 25.37,16.09 25.37,16.1 23.3,16.1 22.3,15.1 v22.3,12.4 | v20.86,10 21.4,10 U14.5
  Bottom 0.152: v22.3,12.4 21.96,12.06 21.96,11.86 20.86,10.76 v20.86,10
GPS_UART_TX  (via drill 0.25)
  Top 0.152: U13.9 31.86,14.7 32.5,14.7 33.04,14.16 v33.04,13.1 | U2.P$2 50,9.3 v47.1,6.4
  Layer2 0.152: v35.2,5.3 35.7,4.8 45.5,4.8 v47.1,6.4
  Bottom 0.152: v33.04,13.1 33.04,11.36 35,9.4 35,5.5 v35.2,5.3
HOST_GPS_STATUS
  Top 0.152: JP1.4 12.82,12.5 U9.P$2 16.6,12.5 R14.P$2
HOST_RX_STATUS
  Top 0.152: R15.P$2 16.8,11.1 16.6,11.3 U9.P$7 15.26,11.28 13.97,11.28 13.59,10.89 JP1.6
HOST_TX_OFF  (via drill 0.25)
  Top 0.152: U17.2 v20.6,12.7 20.23,12.7 19.43,13.5 16.38,13.5 16.28,13.4 15.17,13.4 15.09,13.48 14.61,13.48 14.53,13.4 U9.P$1 14.3,13.42 14.3,13.9 13.73,14.47 13.51,14.47 12,15.97 JP1.2 | R18.P$2 21.4,7.8 20.2,9 v20,9
  Layer2 0.152: v20,9 20,9.85 20.16,10.01 20.16,12.26 v20.6,12.7
HOST_TX_STATUS
  Top 0.152: JP1.7 13.12,9.62 13.9,10.4 U9.P$6 15.6,10.4 R17.P$2
HOST_UART_RX  (via drill 0.25)
  Top 0.152: R13.P$2 v22.6,20 | U9.P$8 14.9,12.1 | 14.9,12.1 13.85,12.1 13.79,12.16 9.36,12.16 JP1.5 | v14.92,12.04 14.9,12.06 14.9,12.1
  Bottom 0.152: v22.6,20 22.2,19.6 22.2,15.3 18.94,12.04 v14.92,12.04
HOST_UART_TX  (via drill 0.25)
  Top 0.152: JP1.3 12.39,14.71 13.84,13.26 13.84,13.15 13.97,13.02 v14.9,13.02 15.26,13.02 U9.P$9 | v21.7,15.7 22.4,15.7 23.6,16.9 R2.P$2
  Bottom 0.152: v21.7,15.7 21.7,15.6 19.12,13.02 v14.9,13.02
I2C_SCL
  Top 0.152: U13.29 26.32,11.28 26.32,10.79 24.17,8.64 24.17,4.95 24.63,4.5 24.63,3.31 24.15,2.83 U15.1
I2C_SDA  (via drill 0.25)
  Top 0.152: U13.30 26.63,10.88 26.63,10.67 25.6,9.64 v25.6,9.2 | U15.3 26.05,2.2 25.75,2.5 v25.7,2.5
  Layer2 0.152: v25.6,9.2 25.6,4.35 25.66,4.29 25.66,2.54 v25.7,2.5
MCU_TX_OFF  (via drill 0.25)
  Top 0.152: U13.22 25.41,15.4 v23.3,15.4
  Bottom 0.152: v23.3,15.4 23.1,15.2 U17.6
  other vias: 23.1,13.35
MCU_UART_RX
  Top 0.152: RX.TP 26.5,18.6 R2.P$1 | U13.20 25.2,17.02 R2.P$1 | U6.1 23.61,21.38 24.4,20.59 24.4,19.3 25.1,18.6 R2.P$1
MCU_UART_TX  (via drill 0.25)
  Top 0.152: U13.19 25.86,17.07 v25.86,17.7 | TX.TP 26.18,21.38 U6.2 25.44,20.24 R13.P$1 25.7,20 v26.2,20.5
  Bottom 0.152: v26.2,20.5 26.2,18.04 v25.86,17.7
MISO  (via drill 0.25)
  Top 0.152: U11.13 33.98,19.08 v33.6,18.7 | v31.8,17 31.8,16.76 U13.12 | U12.13 35.54,7.1 34.77,7.1 34,7.87 34,15.4 v33.9,15.5
  Layer2 0.152: v33.9,15.5 33.9,16.4 33.66,16.64 32.61,16.64 32.25,17 v31.8,17
  Bottom 0.152: v33.6,18.7 31.9,17 v31.8,17
MOSI  (via drill 0.25)
  Top 0.152: U11.14 34.19,18.58 v33.7,18.09 | v32.17,18.03 32.17,18.02 31.34,17.19 31.34,17.01 U13.13 | U12.14 35.54,6.6 34.74,6.6 33.5,7.84 33.5,14.75 33.5,14.76 v33.5,14.8
  Layer2 0.152: v32.17,18.03 32.24,18.1 v33.69,18.1 v33.7,18.09 34.66,17.13 34.66,15.61 34.09,15.04 33.75,15.04 v33.5,14.8
N$1
  Top 0.406: U5.6 50.35,15 C12.P$2
N$2
  Top 1: L8.P$2 C9.P$1
N$3
  Top 1: C9.P$2 C8.P$1 L14.P$2 C10.P$1
N$4
  Top 1: C10.P$2 L13.P$1
N$5
  Top 1: L13.P$2 52.3,12.6 C12.P$1
N$6
  Top 0.406: U5.1 C13.P$1 R10.P$2
N$7
  Top 0.254: U2.P$8 54.2,2.7 53.4,3.5 C5.P$1 C3.P$1 49.82,3.5 49.42,3.9 Q2.3
N$8
  Top 0.254: C2.P$2 15.85,18.65 | 15.85,18.65 U1.6 | 15.85,18.65 14.72,18.65 D4.C L12.P$1
N$9
  Top 0.406: U5.3 47.35,13.65 C18.P$1
N$10
  Top 0.152: R7.P$1 57.7,15 D1.C 59.85,16 Q3.1
N$12
  Top 1: L6.P$1 C23.P$1 L1.P$2
N$13
  Top 0.152: R14.P$1 19.9,12.6 21.1,11.4 22.25,11.4 U14.3
N$14
  Top 0.152: R15.P$1 19.9,11 20.4,10.5 20.4,9.7 20.85,9.25 U14.6
N$15
  Top 0.406: 75.5,12.7 U3.P$2
  Top 1: J$1.SIG RF.TP 75.5,12.7
N$16
  Top 0.152: X2.1 35.64,1.79 36.61,2.76 U12.16
N$17
  Top 0.152: U12.17 37.11,4 X2.3
N$18
  Top 0.152: X1.1 35.85,13.59 36.76,14.5 U11.16
N$19
  Top 0.152: U11.17 37.26,15.76 X1.3
N$20  (via drill 0.25)
  Top 0.152: R17.P$1 18.8,9.3 v19.7,10.2
  Bottom 0.152: v19.7,10.2 21.5,12 U17.3
  other vias: 21.5,12.05
N$21
  Top 0.254: C2.P$1 16.55,16.35 U1.1
N$22
  Top 0.152: R24.P$2 R21.P$1 20.6,18.5 20.07,17.97 20.07,16.57 19.85,16.35 U1.3
N$23
  Top 1: L9.P$1 C39.P$1 C37.P$1 69.79,20.39 L4.P$2 67.49,20.39 U7.3
N$24
  Top 0.254: U11.4 40.68,19.58 41.2,20.1
  Top 1: C22.P$1 41.2,20.1 L5.P$2
N$26
  Top 0.152: L17.P$1 62.7,20.9 L3.P$2
  Top 1: L3.P$2 U7.1
N$27
  Top 0.254: U1.5 19.2,18.65 | 19.2,18.65 U1.4 | C43.P$1 19.2,21.6 19.2,20.3 C1.P$1 | C1.P$1 19.2,20.1 19.2,18.65 | L2.P$2 18.3,21 C1.P$1
N$28
  Top 1: L10.P$1 C36.P$1 L9.P$2
N$29
  Top 1: L3.P$1 C30.P$1 C29.P$2
N$30
  Top 1: L5.P$1 41.1,22.6 R22.P$1 C21.P$1
N$31
  Top 1: L1.P$1 46.4,19.8 46.1,20.1 C22.P$2
N$32  (via drill 0.25)
  Top 0.152: v64.2,16.1 64.5,15.8 R6.P$1 | R3.P$2 67.2,16.5 v66.5,16.5 66.5,17.3 66.2,17.6 U4.P$2
  Layer2 0.152: v64.2,16.1 64.6,16.5 v66.5,16.5
N$33
  Top 1: U10.P$1 Z2.P$2 Z1.P$1
N$36
  Top 1: U2.P$11 Z3.P$2 Z1.P$2
N$40
  Top 1: C42.P$1 L23.P$1 | L10.P$2 C42.P$1 | C42.P$1 C52.P$1
N$41
  Top 1: C53.P$1 73.2,17.9 73.51,17.59 C44.P$1 L23.P$2
NRST  (via drill 0.25)
  Top 0.152: U13.4 31.1,10.42 31.1,8.75 31.86,7.99 31.86,6.91 30.42,5.47 29.67,5.47 28.35,4.15 | JLINK.2 19.8,4.34 NRST.TP 21.3,4.4 v21.5,4.6 | v27.5,4.2 28.3,4.2 28.35,4.15 | 28.35,4.15 S1.P$1
  Bottom 0.152: v21.5,4.6 27.1,4.6 v27.5,4.2
PA_GATE_BIAS
  Top 0.152: R11.P$1 R12.P$2 C11.P$1 L17.P$2
PA_IN
  Top 1: L6.P$2 C29.P$1
PA_OUT
  Top 0.406: C44.P$2 73.51,13.61 U3.P$5
RF_IN
  Top 0.406: U3.P$11 73.5,10.6
  Top 1: L8.P$1 67.4,12.6 69.7,10.3 73.2,10.3 73.5,10.6
RFSW_CTRL
  Top 0.152: U11.20 39.77,17.03 40.2,16.6 Q1.1
RX_EN  (via drill 0.25)
  Top 0.152: v70.9,13.4 71.1,13.4 71.3,13.2 U3.P$7 | R4.P$2 R5.P$2 v55.7,16.5
  Layer2 0.152: v55.7,16.5 58.95,16.5 59.21,16.24 61.56,16.24 62.5,15.3 69.5,15.3 70.9,13.9 v70.9,13.4
RX_IC_CLK  (via drill 0.25)
  Top 0.152: v24.5,10.4 v24.5,10.41 24.93,10.84 24.93,12.01 U13.26 | v39,4 38.61,4.39 U12.20
  Layer2 0.152: v24.5,10.4 24.5,4.8 v25.2,4.1
  Bottom 0.152: v25.2,4.1 26.95,4.1 27.31,3.74 27.69,3.74 27.95,4 v39,4
RX_IC_DATA  (via drill 0.25)
  Top 0.152: U13.27 25.4,11.77 v25.4,11.3 | U12.10 36.27,9.13 v36,9.4
  Layer2 0.152: v25.4,11.3 25.55,11.15 25.76,11.15 29.02,7.89 v29.02,7.02 | v32.68,7.08 32.88,7.08 35.2,9.4 v36,9.4
  Bottom 0.152: v29.02,7.02 29.23,7.02 30.41,5.84 30.79,5.84 32.03,7.08 v32.68,7.08
RX_IN
  Top 0.254: 41,6.6 39.68,6.6 arc90 U12.2 | 41.2,18.6 39.83,18.6 arc90 U11.2
  Top 1: 41,6.6 42.06,6.6 arc90 44.6,9.14 44.6,12.1 | 44.6,12.1 44.6,16.06 arc90 42.06,18.6 41.2,18.6 | C18.P$2 44.7,12 44.6,12.1
RX_STATUS  (via drill 0.25)
  Top 0.152: U13.7 31.54,12.1 v31.6,12.1 | U14.2 23.6,9.9 v23.8,9.7
  Bottom 0.152: v23.8,9.7 24.8,8.7 29.6,8.7 29.84,8.94 29.84,10.3 31.6,12.06 v31.6,12.1
SCK  (via drill 0.25)
  Top 0.152: U11.12 33.68,19.58 32.8,18.7 v32.8,17.1 32.8,17.05 U13.11 | U12.12 34.82,7.58 34.4,8 34.4,16.94 v34.2,16.94
  Layer2 0.152: v34.2,16.94 33.94,17.2 32.9,17.2 v32.8,17.1
SDN1  (via drill 0.25)
  Top 0.152: U13.14 30,16.37 v30,16.4 | v39.9,17.5 39.81,17.59 U11.1
  Bottom 0.152: v30,16.4 34.4,16.4 35.5,17.5 v39.9,17.5
SDN2  (via drill 0.25)
  Top 0.152: U13.25 24.47,12.26 v24.47,11.03 | U12.1 39.9,5.84 v39.9,5.39
  Bottom 0.152: v24.47,11.03 23.1,9.65 23.1,6.2 24.39,4.91 27.23,4.91 27.33,4.8 39.31,4.8 v39.9,5.39
SWCLK  (via drill 0.25)
  Top 0.152: U13.24 24.85,13.7 v24.8,13.7 | v17.9,5.1 17.7,5.1 17,4.4 | 17,4.4 14.92,2.32 JLINK.3 | SWCLK.TP 17,4.4
  Bottom 0.152: v24.8,13.7 24.8,12 v17.9,5.1
SWDIO  (via drill 0.25)
  Top 0.152: U13.23 25.1,15 24.5,15 24.1,14.6 v24.1,14.1 | v15.5,4.6 15.3,4.4 SWDIO.TP 12.38,2.88 JLINK.4
  Bottom 0.152: v15.5,4.6 16.32,4.6 24.1,12.38 v24.1,14.1
TRX_IC_CLOCK  (via drill 0.25)
  Top 0.152: U13.3 v30.5,10.31 | v38.3,16.17 38.26,16.21 U11.19
  Bottom 0.152: v30.5,10.31 31.01,10.31 32.2,11.5 32.2,13.5 33.04,14.34 33.69,14.34 33.75,14.4 34.1,14.4 35,15.3 35,15.8 35.37,16.17 v38.3,16.17
TRX_IC_DATA
  Top 0.152: U13.15 34.05,21.13 U11.10
TX_STATUS  (via drill 0.25)
  Top 0.152: U13.28 26.34,11.93 26.02,11.61 26.02,11.13 v25.57,10.69 | U17.5 v23.6,12.7
  Layer2 0.152: v23.6,12.7 23.6,12.66 24.94,11.32 24.94,11.11 25.21,10.84 25.42,10.84 v25.57,10.69
V_IN  (via drill 0.25)
  Top 0.152: R7.P$2 v53.4,15.6
  Top 0.406: JP1.1 9.35,19.95 V_IN.TP 14.4,21.9 15.5,23 L2.P$1 | L2.P$1 16.7,23.1 v17.4,23.1 | L2.P$1 19.2,23 C4.P$1 | C47.P$1 v59.3,17 | C47.P$1 61.8,17.6 U4.P$5 U4.P$6 | Q3.3 61.6,16.6 C47.P$1
  Layer2 0.152: v53.4,15.6 54.8,17 v59.3,17
  Layer2 0.406: v17.4,23.1 27.1,23.1 27.4,23.4 56.5,23.4 57.88,22.02 v57.88,20.78
  Bottom 0.406: v57.88,20.78 57.88,18.42 v59.3,17
V_LNA  (via drill 0.25)
  Top 0.152: Q1.3 42.4,15.4 42.6,15.6 v43,15.6 | R10.P$1 V_LNA.TP 51.7,18 v52.7,18 52.8,17.9 R4.P$1
  Layer2 0.152: v47,15.49 49.51,18 v52.7,18
  Bottom 0.152: v43,15.6 46.89,15.6 v47,15.49
V_PA
  Top 0.152: V_PA.TP 68.5,15.2 68.6,15.3
  Top 0.406: U4.P$1 65.9,16.85 65.9,15.8 R6.P$2 66.15,15.55 | 66.15,15.55 66.4,15.3 68.6,15.3 C49.P$1 | 69.3,18.1 69.21,18.19 69.01,18.19 | Q3.2 65.1,14.5 66.15,15.55
  Top 1.016: C49.P$1 C7.P$1 69.3,18.1 | 69.01,18.19 L4.P$1
V_PA_BIAS  (via drill 0.25)
  Top 0.152: U13.18 27.4,16.41 27.08,16.73 27.08,18.01 27.96,18.89 27.96,20.12 30.54,22.7 v34,22.7 | v51.7,22.6 51.8,22.5 54.9,22.5 R11.P$2
  Bottom 0.152: v51.7,22.6 49.8,22.6 49.2,23.2 34.5,23.2 v34,22.7
(copper drawn outside any net)
  shapes: Top area x4

### Text on the board
Top: MAIANA™
tNames: Rev 11.8.0 | ©2015-2021 / P. Antypas
bNames: JLCJLCJLCJLC
Document: STACKUP: / ====== / / L1 : 35um / Prepreg : 0.17mm / L2 : 18um / Core : 1.2mm TG140-170, er=4.5 / L3 : 18um / Prepreg : 0.17mm / L4 : 35um | MAIANA™ AIS Transponder / Copyright © 2015-2020 Peter Antypas / Licensed under GPLv3 | Contact: peter.antypas@gmail.com